# Altium project lorawan_gateway.PrjPcb (part 1 of 2)
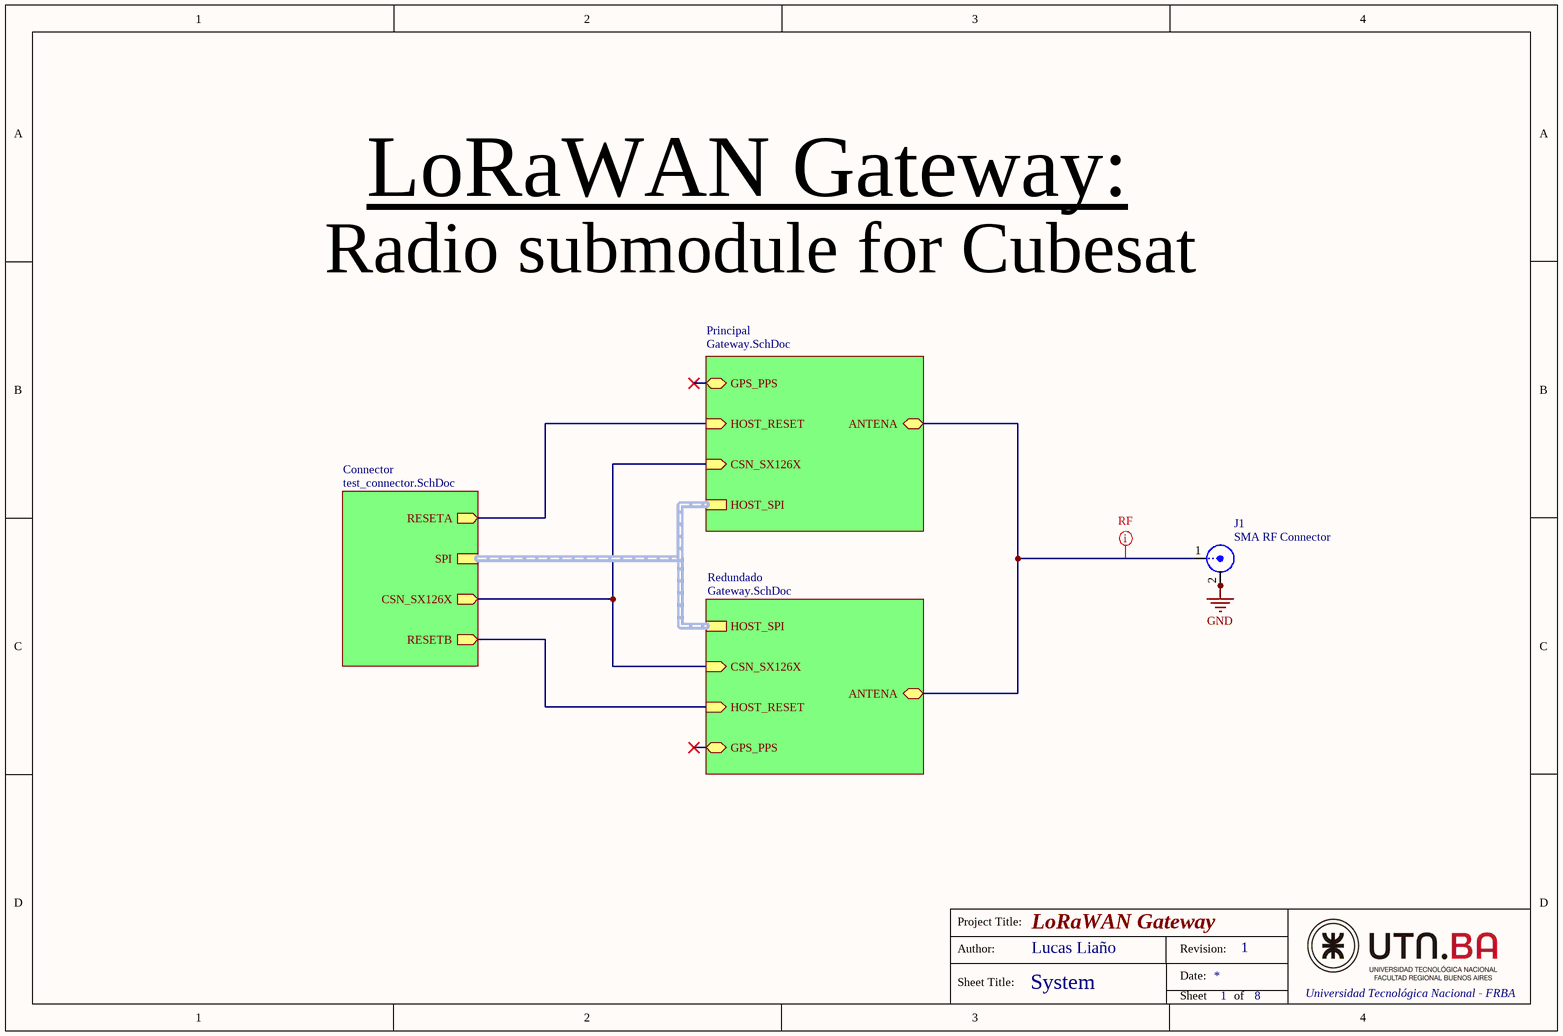
[diagram p0: System.SchDoc]
ProjectTitle: LoRaWAN Gateway; UTN: Universidad Tecnológica Nacional - FRBA
8 sheets, 253 parts. Net scope: hierarchical (ports join the sheet entries above them; power ports are global).
Board files: pci_104.PcbDoc, panel.PcbDoc
Sheets:
  System.SchDoc
    Principal = Gateway.SchDoc
      SX1302 = SX1302.SchDoc
      RADIOA = SX1250.SchDoc
      RADIOB = SX1250.SchDoc
      RADIOC = SX126x.SchDoc
      FrontEnd = FrontEnd.SchDoc
      Power = Power.SchDoc
    Redundado = Gateway.SchDoc
      SX1302 = SX1302.SchDoc
      RADIOA = SX1250.SchDoc
      RADIOB = SX1250.SchDoc
      RADIOC = SX126x.SchDoc
      FrontEnd = FrontEnd.SchDoc
      Power = Power.SchDoc
    Connector = test_connector.SchDoc

## Sheet System.SchDoc: System
size A4; Author: Lucas Liaño; Revision: 1; SheetNumber: 1; SheetTotal: 8

### Parts
J1  SMA RF Connector  [SMA THT connector]

### Sub-sheets
Connector = test_connector.SchDoc: SPI (harness HOST_SPI), RESETA (out), RESETB (out), CSN_SX126X (out)
Principal = Gateway.SchDoc: GPS_PPS (bidir), HOST_RESET (in), ANTENA (bidir), HOST_SPI (harness HOST_SPI), CSN_SX126X (in)
Redundado = Gateway.SchDoc: ANTENA (bidir), GPS_PPS (bidir), HOST_RESET (in), HOST_SPI (harness HOST_SPI), CSN_SX126X (in)

### Nets
GND: J1.2(GND)
GPIO1: sheet Principal/HOST_RESET, sheet Connector/RESETA
GPIO2: sheet Redundado/HOST_RESET, sheet Connector/RESETB
SPI_CSN_SX126X: sheet Principal/CSN_SX126X, sheet Redundado/CSN_SX126X, sheet Connector/CSN_SX126X
NetC41A_1: J1.1(Signal) ; sheet Principal/ANTENA, sheet Redundado/ANTENA

### Buses and harness runs
harness sheet Connector/SPI = sheet Principal/HOST_SPI = sheet Redundado/HOST_SPI

### Layout directives
net class RF: NetC41A_1

### Notes on the sheet
- LoRaWAN Gateway:
- Radio submodule for Cubesat
- Project Title:
- Author:
- Sheet Title:
- Date:
- Revision:
- Sheet
- of

### Library data of the parts
J1 = SMA: SMA 50 Ohm military grade THT connector; Manufacturer: TE Connectivity Aerospace, Defense and Marine; MPN: 1053374-1; Value: SMA female; ComponentLink1Description: Datasheet; ComponentLink1URL: https://www.te.com/commerce/DocumentDelivery/DDEController?Action=srchrtrv&DocNm=1053374&DocType=Customer+Drawing&DocLang=English; ComponentLink2Description: SupplierLink; ComponentLink2URL: https://www.digikey.com/en/products/detail/te-connectivity-aerospace-defense-and-marine/1053374-1/1131391; Package: SMA; Price (USD): 56; Supplier: Digikey

## Sheet Gateway.SchDoc: Gateway
size A3; Author: Lucas Liaño; Revision: 1; SheetNumber: 2; SheetTotal: 8
Used 2 times, as channels Principal, Redundado. Parts and nets are listed once, with the designators drawn on the sheet.
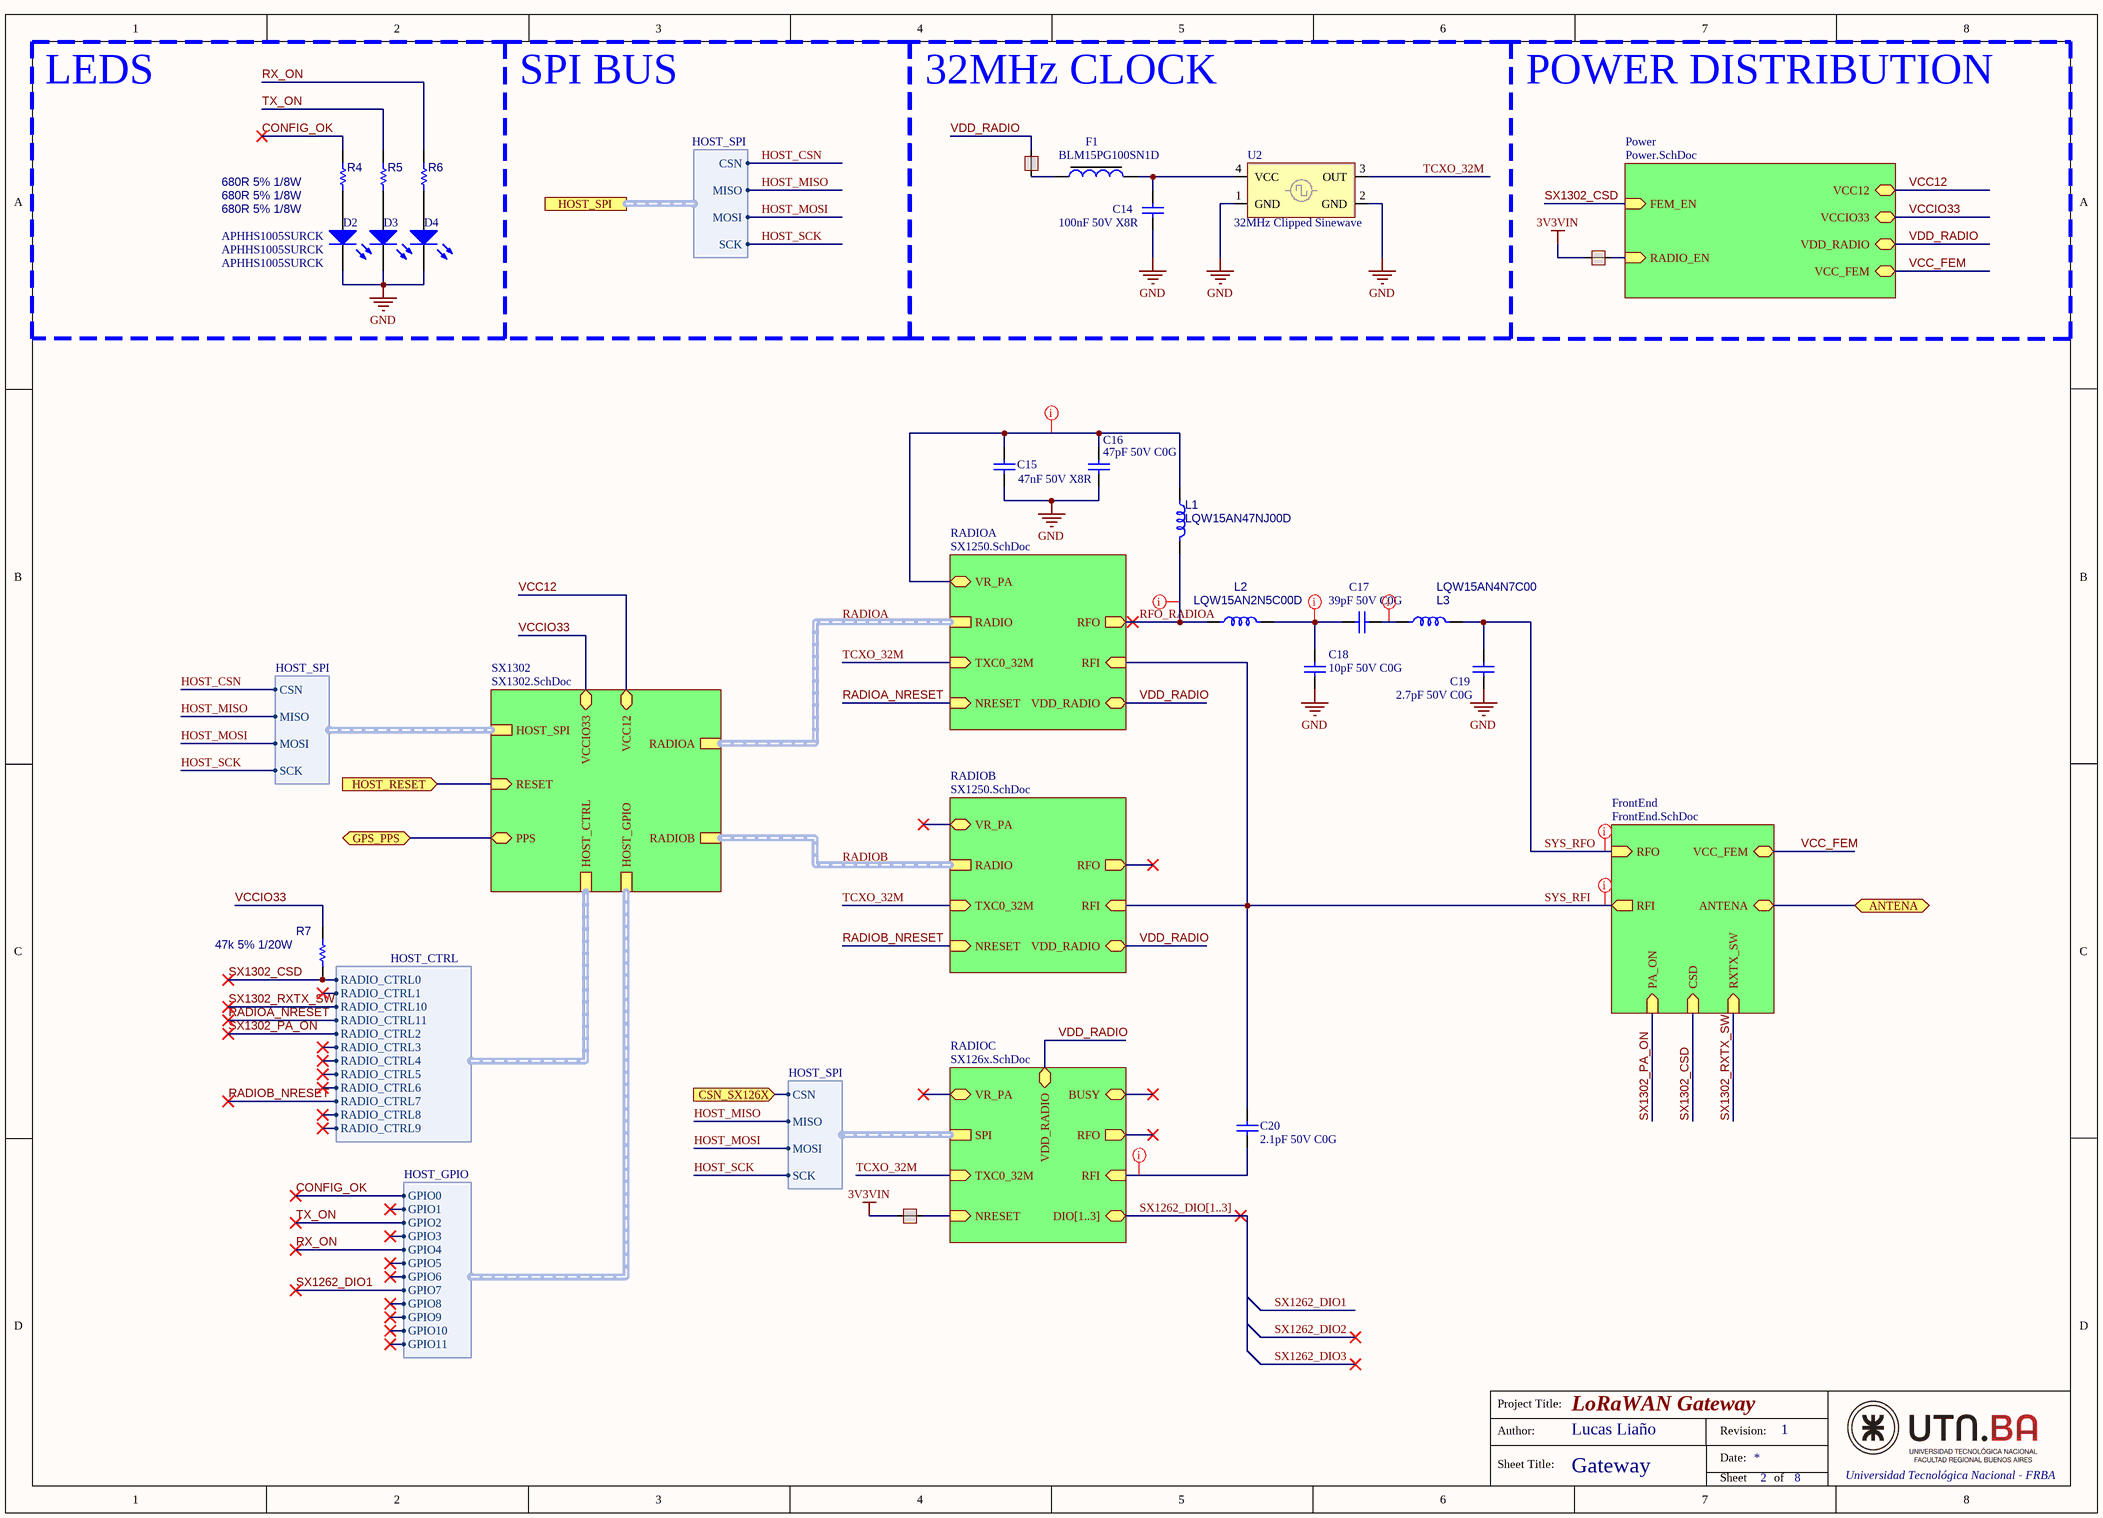
[diagram p1: Gateway.SchDoc]

### Parts
C14  100nF 50V X8R  [C_0603]
C15  47nF 50V X8R  [C_0603]
C16  47pF 50V C0G  [C_0603]
C17  39pF 50V C0G  [C_0603]
C18  10pF 50V C0G  [C_0603]
C19  2.7pF 50V C0G  [C_0603]
C20  2.1pF 50V C0G  [C_0603]
D2  APHHS1005SURCK  [D_0402]
D3  APHHS1005SURCK  [D_0402]
D4  APHHS1005SURCK  [D_0402]
F1  BLM15PG100SN1D  [L_0402]
L1  LQW15AN47NJ00D  [L_0402]
L2  LQW15AN2N5C00D  [L_0402]
L3  LQW15AN4N7C00  [L_0402]
NT1  NT  [NTIE12]  (value not drawn)  (net tie, no BOM)
NT13  NT  [NTIE12]  (value not drawn)  (net tie, no BOM)
NT15  NT  [NTIE12]  (value not drawn)  (net tie, no BOM)
R4  680R 5% 1/8W  [0603[1608]]
R5  680R 5% 1/8W  [0603[1608]]
R6  680R 5% 1/8W  [0603[1608]]
R7  47k 5% 1/20W  [0603[1608]]
U2  32MHz Clipped Sinewave  [TCXO 2.0x1.6mm]

### Blocks framed on the sheet
LEDS: D2-D4 R4-R6

### Sub-sheets
FrontEnd = FrontEnd.SchDoc: ANTENA (bidir), RFO (in), RFI (out), PA_ON (in), CSD (in), RXTX_SW (in), VCC_FEM (bidir)
Power = Power.SchDoc: FEM_EN (in), RADIO_EN (in), VCC12 (bidir), VCCIO33 (bidir), VDD_RADIO (bidir), VCC_FEM (bidir)
RADIOA = SX1250.SchDoc: RFI (in), VR_PA (bidir), RADIO (harness RADIO), NRESET (in), RFO (out), TXC0_32M (in), VDD_RADIO (bidir)
RADIOB = SX1250.SchDoc: VR_PA (bidir), RFO (out), RADIO (harness RADIO), NRESET (in), RFI (in), TXC0_32M (in), VDD_RADIO (bidir)
RADIOC = SX126x.SchDoc: RFI (in), DIO[1..3] (bidir), RFO (out), NRESET (in), SPI (harness HOST_SPI), VR_PA (bidir), TXC0_32M (in), BUSY (bidir), VDD_RADIO (bidir)
SX1302 = SX1302.SchDoc: RADIOB (harness RADIO), HOST_GPIO (harness HOST_GPIO), PPS (bidir), RESET (in), RADIOA (harness RADIO), HOST_CTRL (harness HOST_CTRL), HOST_SPI (harness HOST_SPI), VCCIO33 (bidir), VCC12 (bidir)

### Ports
ANTENA (bidir), CSN_SX126X (in), GPS_PPS (bidir), HOST_RESET (in), HOST_SPI (harness HOST_SPI)

### Harnesses
HOST_CTRL: RADIO_CTRL0, RADIO_CTRL1, RADIO_CTRL10, RADIO_CTRL11, RADIO_CTRL2, RADIO_CTRL3, RADIO_CTRL4, RADIO_CTRL5, RADIO_CTRL6, RADIO_CTRL7, RADIO_CTRL8, RADIO_CTRL9
HOST_GPIO: GPIO1, GPIO2, GPIO3, GPIO4, GPIO5, GPIO6, GPIO7, GPIO8, GPIO9, GPIO10, GPIO11, GPIO0
HOST_SPI: CSN, MISO, MOSI, SCK

### Nets
3V3VIN: NT1.1 NT15.1
GND: C14.2 C15.2 C16.2 C18.1 C19.2 D2.2(K) D3.2(K) D4.2(K) U2.1(GND) U2.2(GND)
ANTENA: port ANTENA, sheet FrontEnd/ANTENA
CONFIG_OK: R4.2 ; sheet SX1302/HOST_GPIO.GPIO0
CSN_SX126X: port CSN_SX126X, sheet RADIOC/SPI.CSN
GPS_PPS: port GPS_PPS, sheet SX1302/PPS
HOST_CSN: port HOST_SPI.CSN, sheet SX1302/HOST_SPI.CSN
HOST_MISO: port HOST_SPI.MISO, sheet SX1302/HOST_SPI.MISO, sheet RADIOC/SPI.MISO
HOST_MOSI: port HOST_SPI.MOSI, sheet SX1302/HOST_SPI.MOSI, sheet RADIOC/SPI.MOSI
HOST_RESET: port HOST_RESET, sheet SX1302/RESET
HOST_SCK: port HOST_SPI.SCK, sheet SX1302/HOST_SPI.SCK, sheet RADIOC/SPI.SCK
RADIOA_NRESET: sheet RADIOA/NRESET, sheet SX1302/HOST_CTRL.RADIO_CTRL11
RADIOB_NRESET: sheet RADIOB/NRESET, sheet SX1302/HOST_CTRL.RADIO_CTRL7
RFO_RADIOA: L1.2 L2.1 ; sheet RADIOA/RFO
RX_ON: R6.2 ; sheet SX1302/HOST_GPIO.GPIO4
SX1302_CSD: R7.1 ; sheet FrontEnd/CSD, sheet Power/FEM_EN, sheet SX1302/HOST_CTRL.RADIO_CTRL0
SX1302_PA_ON: sheet FrontEnd/PA_ON, sheet SX1302/HOST_CTRL.RADIO_CTRL2
SX1302_RXTX_SW: sheet FrontEnd/RXTX_SW, sheet SX1302/HOST_CTRL.RADIO_CTRL10
SYS_RFI: C20.2 ; sheet RADIOA/RFI, sheet RADIOB/RFI, sheet FrontEnd/RFI
SYS_RFO: C19.1 L3.2 ; sheet FrontEnd/RFO
TCXO_32M: U2.3(OUT) ; sheet RADIOA/TXC0_32M, sheet RADIOB/TXC0_32M, sheet RADIOC/TXC0_32M
TX_ON: R5.2 ; sheet SX1302/HOST_GPIO.GPIO2
VCC12: sheet SX1302/VCC12, sheet Power/VCC12
VCC_FEM: sheet FrontEnd/VCC_FEM, sheet Power/VCC_FEM
VCCIO33: R7.2 ; sheet SX1302/VCCIO33, sheet Power/VCCIO33
VDD_RADIO: NT13.2 ; sheet RADIOA/VDD_RADIO, sheet RADIOB/VDD_RADIO, sheet RADIOC/VDD_RADIO, sheet Power/VDD_RADIO
NetC14_1: C14.1 F1.2 U2.4(VCC)
NetC15_1: C15.1 C16.1 L1.1 ; sheet RADIOA/VR_PA
NetC17_1: C17.1 C18.2 L2.2
NetC17_2: C17.2 L3.1
NetC20_1: C20.1 ; sheet RADIOC/RFI
NetD2_1: D2.1(A) R4.1
NetD3_1: D3.1(A) R5.1
NetD4_1: D4.1(A) R6.1
NetF1_1: F1.1 NT13.1
NetNT1_2: NT1.2 ; sheet RADIOC/NRESET
NetNT15_2: NT15.2 ; sheet Power/RADIO_EN

### Channels
Principal: designators end in A; ports ANTENA=NetC41A_1 CSN_SX126X=SPI_CSN_SX126X GPS_PPS=PPS_SX1302 HOST_RESET=GPIO1
Redundado: designators end in B; ports ANTENA=NetC41A_1 CSN_SX126X=SPI_CSN_SX126X GPS_PPS=PPS_SX1302 HOST_RESET=GPIO2

### Buses and harness runs
bus SX1262_DIO[1..3] = sheet RADIOC/DIO[1..3]
harness RADIOA = sheet RADIOA/RADIO = sheet SX1302/RADIOA
harness RADIOB = sheet RADIOB/RADIO = sheet SX1302/RADIOB

### Layout directives
net class RF: NetC17A_1, NetC17A_2, NetC20A_1, RFO_RADIOA_Principal, SYS_RFI_Principal, SYS_RFO_Principal, VR_PA

### Notes on the sheet
- SPI BUS
- 32MHz CLOCK
- POWER DISTRIBUTION
- Project Title:
- Author:
- Sheet Title:
- Date:
- Revision:
- Sheet
- of

### Library data of the parts
C14 = Cap: Capacitor; MPN: GCM188R91H102KA37D; Manufacturer: Murata Electronics; Package: 0603; Price (USD): 0.2; ComponentLink2Description: SupplierLink; ComponentLink1Description: Datasheet; ComponentLink2URL: https://www.digikey.com/es/products/detail/murata-electronics/GCM188R91H102KA37D/6605989; ComponentLink1URL: https://search.murata.co.jp/Ceramy/image/img/A01X/G101/ENG/GCM188R91H102KA37-01.pdf; Value: 100nF 50V X8R; Supplier: Digikey
C15 = Cap: Capacitor; MPN: GCM188R91H472KA37D; Manufacturer: Murata Electronics; Package: 0603; Price (USD): 0.2; ComponentLink2Description: SupplierLink; ComponentLink1Description: Datasheet; ComponentLink2URL: https://www.digikey.com/es/products/detail/murata-electronics/GCM188R91H472KA37D/11618640; ComponentLink1URL: https://search.murata.co.jp/Ceramy/image/img/A01X/G101/ENG/GCM188R91H472KA37-01.pdf; Value: 47nF 50V X8R; Supplier: Digikey
C16 = Cap: Capacitor; MPN: 0603J0500470GAT; Manufacturer: Knowless Syfer; Package: 0603; Price (USD): 0.25; ComponentLink2Description: SupplierLink; ComponentLink1Description: Datasheet; ComponentLink2URL: https://www.digikey.com/es/products/detail/knowles-syfer/0603J0500470GAT/6285001; ComponentLink1URL: https://www.knowlescapacitors.com/getmedia/44a5a400-a1aa-40c4-ac69-22b5f3d40f81/AEC-Q200-Automotive-Grade-Capacitors-Catalog; Value: 47pF 50V C0G; Supplier: Digikey
C17 = Cap: Capacitor; MPN: 06035A390FAT2A; Manufacturer: Kyocera AVX; Package: 0603; Price (USD): 0.45; ComponentLink2Description: SupplierLink; ComponentLink1Description: Datasheet; ComponentLink2URL: https://www.digikey.com/es/products/detail/kyocera-avx/06035A390FAT2A/1599819; ComponentLink1URL: https://datasheets.kyocera-avx.com/C0GNP0-Dielectric.pdf; Value: 39pF 50V C0G; Supplier: Digikey
C18 = Cap: Capacitor; MPN: GRM0335C1H100FA01D; Manufacturer: Murata Electronics; Package: 0603; Price (USD): 0.1; ComponentLink2Description: SupplierLink; ComponentLink1Description: Datasheet; ComponentLink2URL: https://www.digikey.com/es/products/detail/murata-electronics/GRM0335C1H100FA01D/4358087; ComponentLink1URL: https://search.murata.co.jp/Ceramy/image/img/A01X/G101/ENG/GRM0335C1H100FA01-01.pdf; Value: 10pF 50V C0G; Supplier: Digikey
C19 = Cap: Capacitor; MPN: GRM0335C1H2R7WA01D; Manufacturer: Murata Electronics; Package: 0603; Price (USD): 0.1; ComponentLink2Description: SupplierLink; ComponentLink1Description: Datasheet; ComponentLink2URL: https://www.digikey.com/es/products/detail/murata-electronics/GRM0335C1H2R7WA01D/11618507?s=N4IgTCBcDaIOICUCyAGAzGgrAYQIwAkwEB2AdQEEVcAREAXQF8g; ComponentLink1URL: https://search.murata.co.jp/Ceramy/image/img/A01X/G101/ENG/GRM0335C1H2R7WA01-01.pdf; Value: 2.7pF 50V C0G; Supplier: Digikey
C20 = Cap: Capacitor; MPN: ML03512R1BAT2A; Manufacturer: Kyocera AVX; Package: 0603; Price (USD): 0.52; ComponentLink2Description: SupplierLink; ComponentLink1Description: Datasheet; ComponentLink2URL: https://www.digikey.com/es/products/detail/kyocera-avx/ML03512R1BAT2A/2694197; ComponentLink1URL: https://datasheets.kyocera-avx.com/ML03.pdf; Value: 2.1pF 50V C0G; Supplier: Digikey
D2-D4 = LED: Manufacturer: kingbright; Value: LED RED CLEAR CHIP SMD; ComponentLink1Description: Datasheet; ComponentLink2Description: SupplierLink; MPN: APHHS1005SURCK; Package: 0402  [1005]; Price (USD): 0.5; Supplier: Digikey
  D2: ComponentLink1URL: https://www.kingbrightusa.com/images/catalog/SPEC/APHHS1005SURCK.pdf; ComponentLink2URL: https://www.digikey.com/en/products/detail/kingbright/APHHS1005SURCK/1747502
F1 = Ferrite beads: Ferrite bead 10 ohm 1A; Manufacturer: Murata Electronics; ComponentLink1Description: Datasheet; ComponentLink2Description: SupplierLink; MPN: BLM15PG100SN1D; Package: 0402; Price (USD): 0.1; Supplier: Digikey; Value: Ferrite bead 10 ohm 1A
L1-L3 = IND: Inductor; Manufacturer: *; Package: *; Price (USD): *; Value: *; ComponentLink1Description: Datasheet; ComponentLink1URL: *; ComponentLink2Description: SupplierLink; ComponentLink2URL: *
  L1: MPN: LQW15AN47NJ00D
  L2: MPN: LQW15AN2N5C00D
  L3: MPN: LQW15AN4N7C00
NT1 NT13 NT15 = NTIE: NET_TIE; ComponentLink1Description: Datasheet; ComponentLink2Description: SupplierLink
R4-R6 = Res: Resistor; Manufacturer: Panasonic Electronic Components; MPN: ERJ-H3GJ681V; Package: 0603; Price (USD): 0.17; Value: 680R 5% 1/8W; ComponentLink1Description: Datasheet; ComponentLink2Description: SupplierLink; Supplier: Digikey
  R4: ComponentLink1URL: https://www.digikey.com/es/products/detail/panasonic-electronic-components/ERJ-H3GJ681V/13877999; ComponentLink2URL: https://www.digikey.com/es/products/detail/panasonic-electronic-components/ERJ-H3GJ681V/13877999
  R5 R6: ComponentLink1URL: *; ComponentLink2URL: *
R7 = Res: Resistor; Manufacturer: Vishay; MPN: M55342K11B47K0MT1V; Package: 0603; Price (USD): 0.2; Value: 47k 5% 1/20W; ComponentLink1Description: Datasheet; ComponentLink1URL: https://www.digikey.com/es/products/detail/vishay-dale-thin-film/M55342K11B47K0MT1V/3585297?s=N4IgjCBcoExaBjKAzAhgGwM4FMA0IB7KAbRAHYBWGAFhAF18AHAFyhAGVmAnASwDsA5iAC%2B%2BAMzwQSSGix5CJEDAoAGCQxAs2nXoJH4wANknTZOfEUikxATjAUAHPSatIHbvyGilKhxRMoGOYKViDUZAAEANYA8gAWALaYzpquIACqfDzMMcgAstiomACuXNgi3nChZZg8mMwEXMl0wkA; ComponentLink2Description: SupplierLink; ComponentLink2URL: https://www.digikey.com/es/products/detail/vishay-dale-thin-film/M55342K11B47K0MT1V/3585297?s=N4IgjCBcoExaBjKAzAhgGwM4FMA0IB7KAbRAHYBWGAFhAF18AHAFyhAGVmAnASwDsA5iAC%2B%2BAMzwQSSGix5CJEDAoAGCQxAs2nXoJH4wANknTZOfEUikxATjAUAHPSatIHbvyGilKhxRMoGOYKViDUZAAEANYA8gAWALaYzpquIACqfDzMMcgAstiomACuXNgi3nChZZg8mMwEXMl0wkA; Supplier: Digikey
U2 = TCXO: 32MHz TCXO - Clipped Sinewave Output; Manufacturer: NDK America; MPN: NT2016SA 32MHz END4263A; ComponentLink1Description: Datasheet; ComponentLink1URL: https://media.digikey.com/pdf/Data%20Sheets/NDK%20PDFs/NT2016SA-32M-END4263A.pdf; ComponentLink2Description: SupplierLink; ComponentLink2URL: https://www.digikey.com/en/products/detail/ndk-america-inc/NT2016SA-32M-END4263A/8275433; Package: 4-SMD; Price (USD): 1; Supplier: Digikey; Value: 32MHz TCXO - Clipped Sinewave Output

## Sheet SX1302.SchDoc: SX1302
size A2; Author: Lucas Liaño; Revision: 1; SheetNumber: 3; SheetTotal: 8
Used 2 times, as channels Principal/SX1302, Redundado/SX1302. Parts and nets are listed once, with the designators drawn on the sheet.
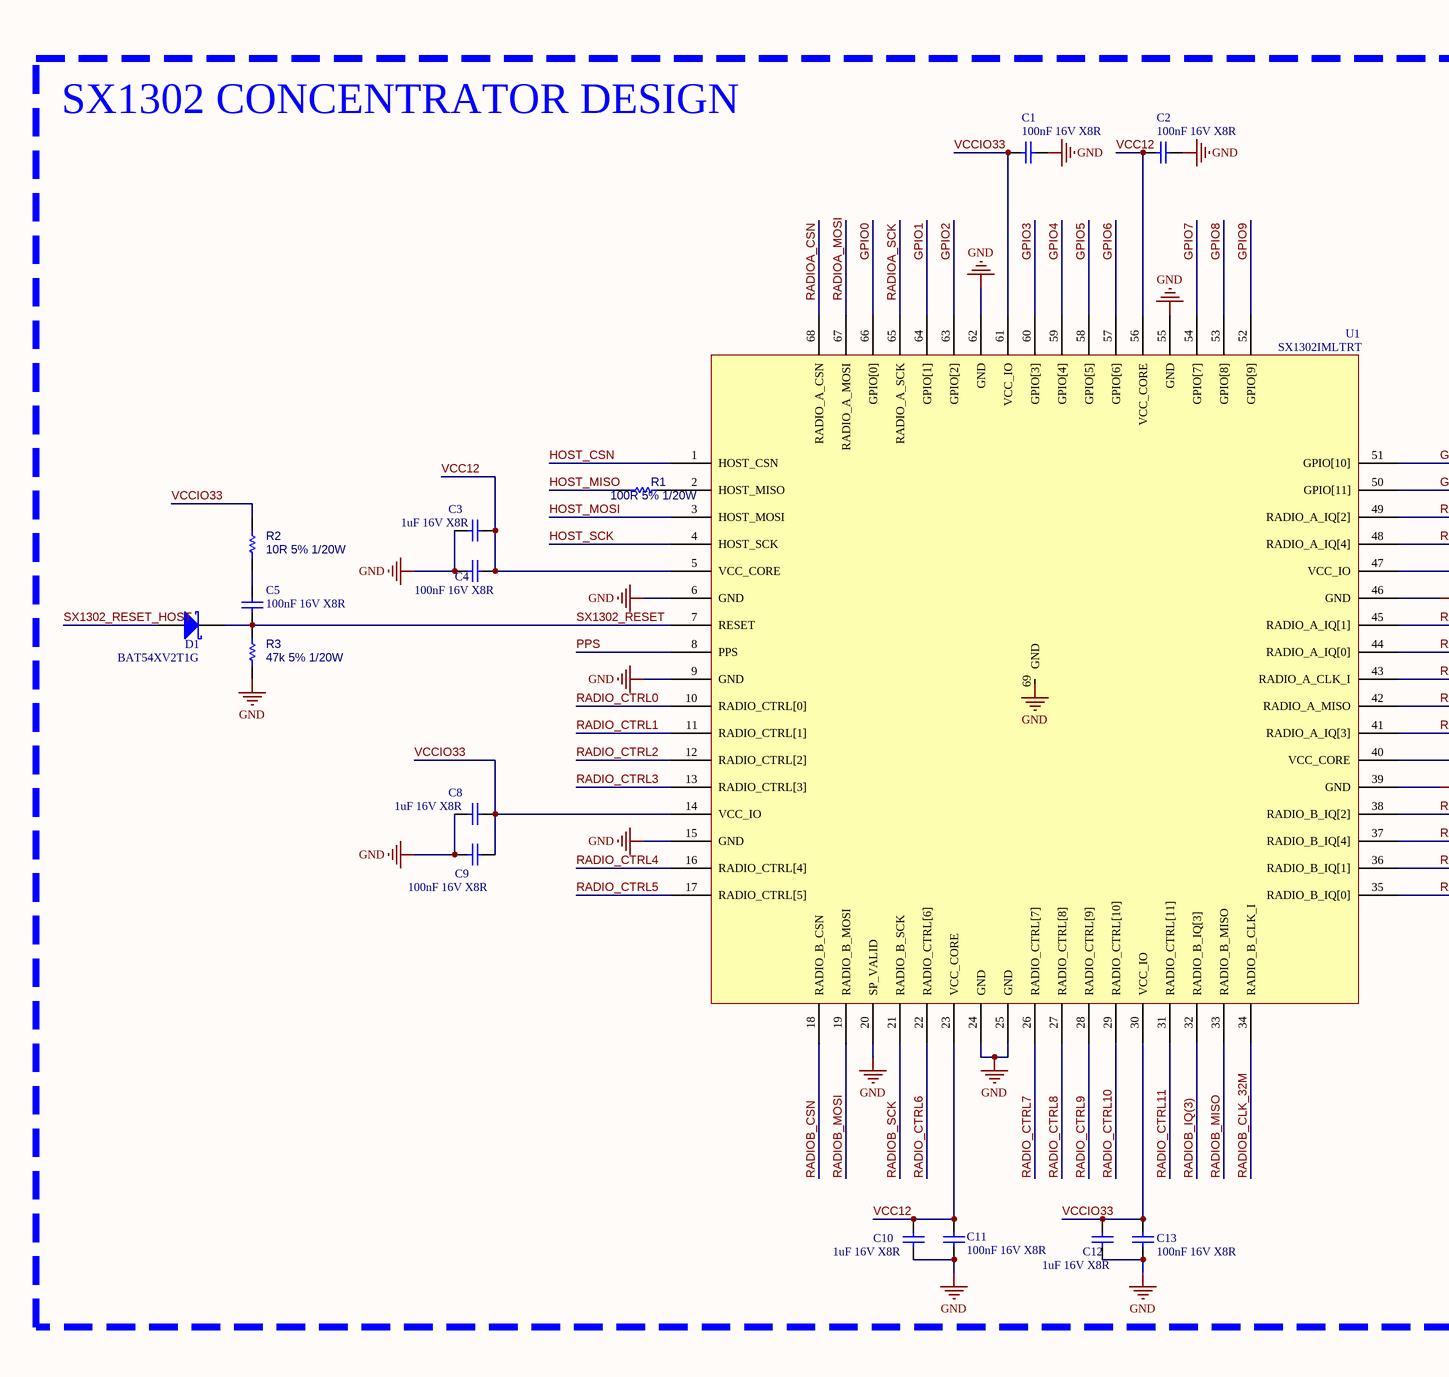
[diagram p2: SX1302.SchDoc, left]
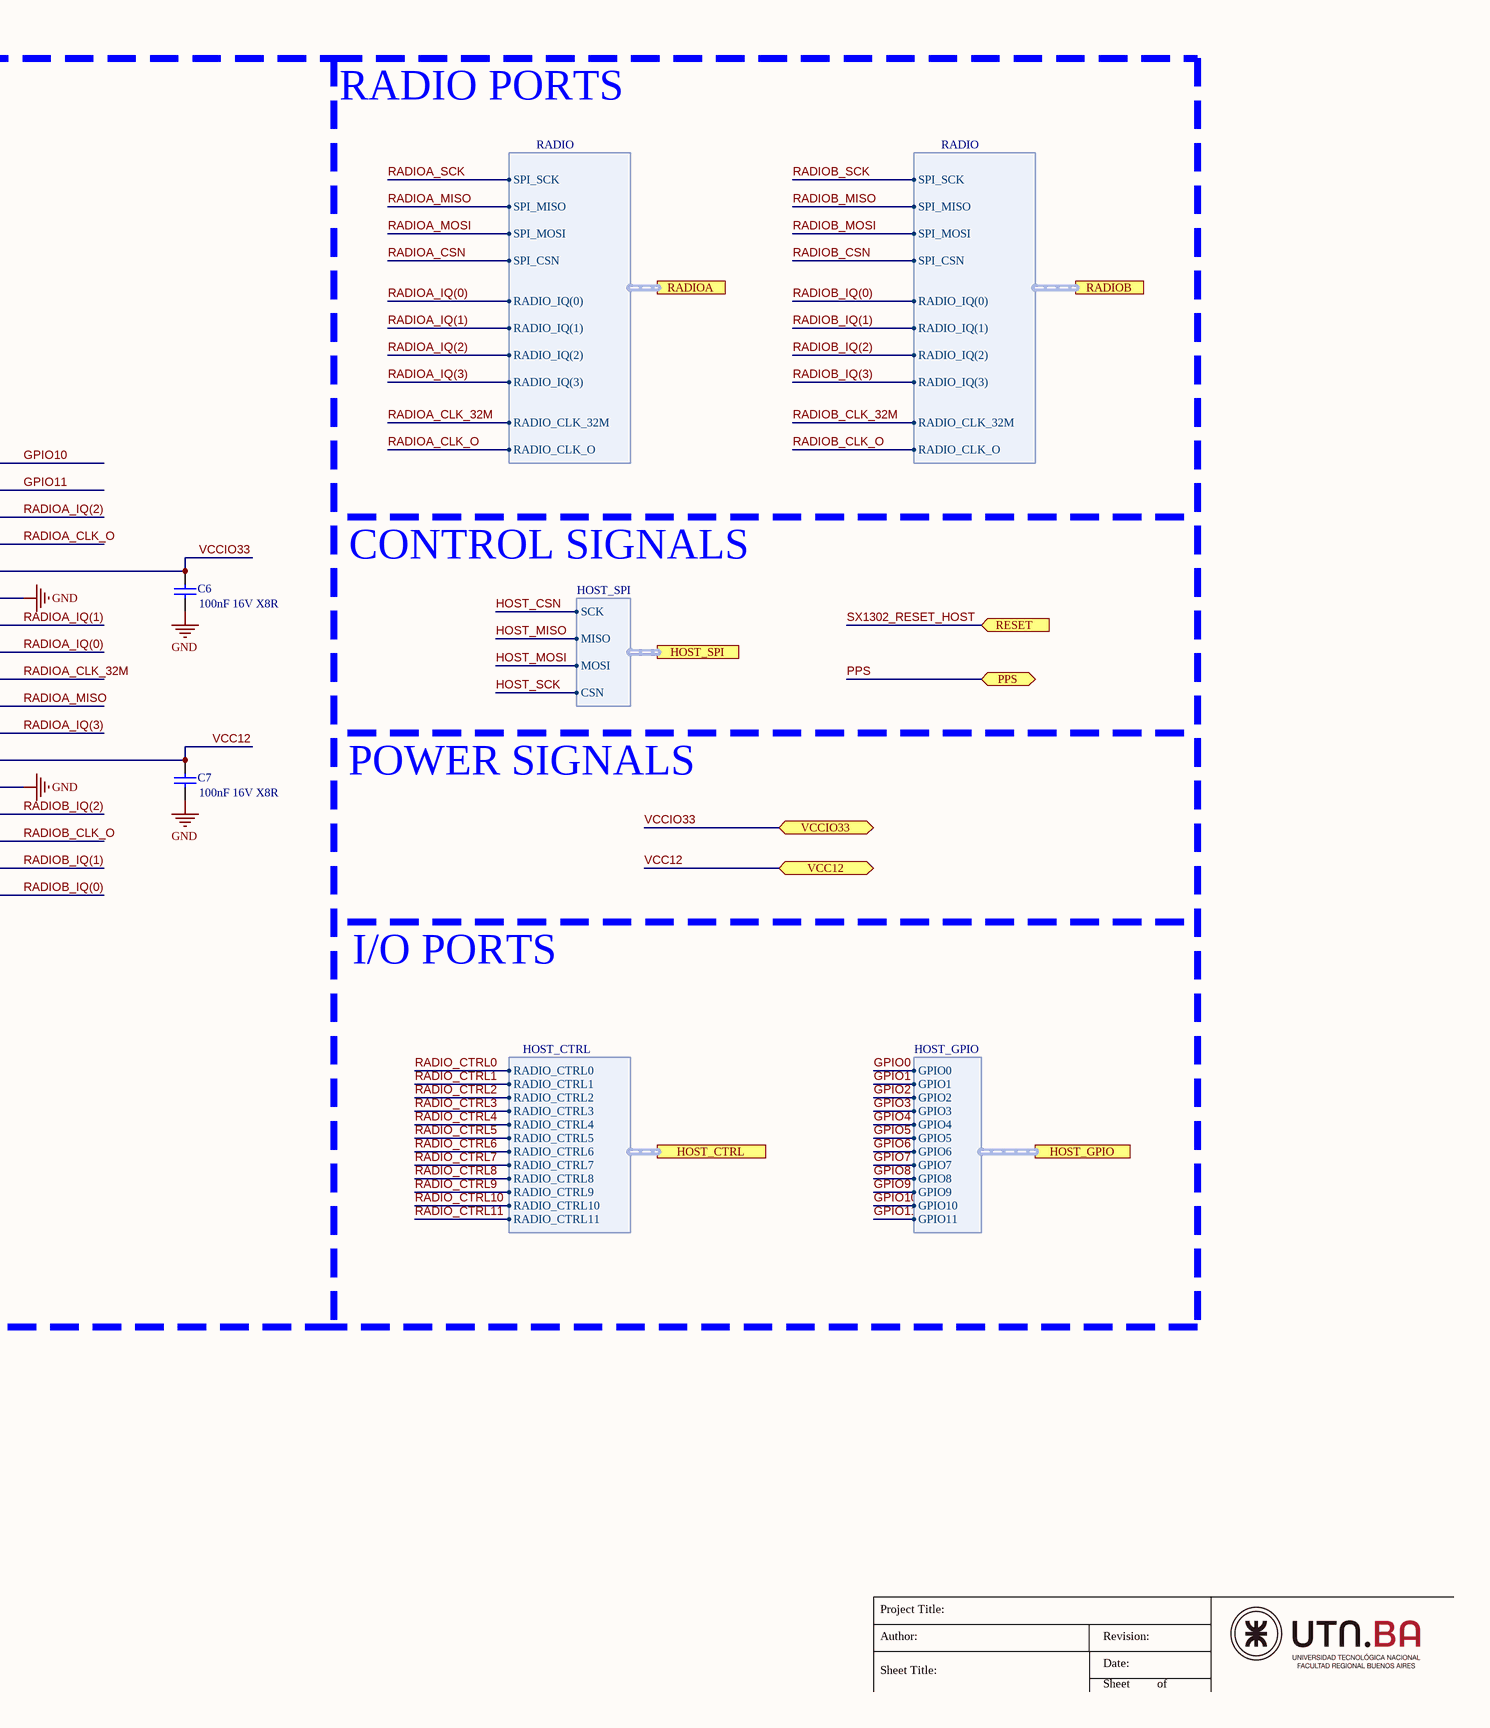
[diagram p3: SX1302.SchDoc, right]

### Parts
C1  100nF 16V X8R  [C_0603]
C2  100nF 16V X8R  [C_0603]
C3  1uF 16V X8R  [C_0603]
C4  100nF 16V X8R  [C_0603]
C5  100nF 16V X8R  [C_0603]
C6  100nF 16V X8R  [C_0603]
C7  100nF 16V X8R  [C_0603]
C8  1uF 16V X8R  [C_0603]
C9  100nF 16V X8R  [C_0603]
C10  1uF 16V X8R  [C_0603]
C11  100nF 16V X8R  [C_0603]
C12  1uF 16V X8R  [C_0603]
C13  100nF 16V X8R  [C_0603]
D1  BAT54XV2T1G  [SOD-523]
R1  100R 5% 1/20W  [0603[1608]]
R2  10R 5% 1/20W  [0603[1608]]
R3  47k 5% 1/20W  [0603[1608]]
U1  SX1302IMLTRT  [vqfn68_7x7mm]

### Blocks framed on the sheet
SX1302 CONCENTRATOR DESIGN: C1-C13 D1 R1-R3 U1

### Ports
HOST_CTRL (harness HOST_CTRL), HOST_GPIO (harness HOST_GPIO), HOST_SPI (harness HOST_SPI), PPS (bidir), RADIOA (harness RADIO), RADIOB (harness RADIO), RESET (in), VCC12 (bidir), VCCIO33 (bidir)

### Harnesses
RADIO: SPI_SCK, SPI_MISO, SPI_MOSI, SPI_CSN, RADIO_IQ(0), RADIO_IQ(1), RADIO_IQ(2), RADIO_IQ(3), RADIO_CLK_32M, RADIO_CLK_O
HOST_SPI: SCK, MISO, MOSI, CSN
HOST_CTRL: RADIO_CTRL0, RADIO_CTRL1, RADIO_CTRL2, RADIO_CTRL3, RADIO_CTRL4, RADIO_CTRL5, RADIO_CTRL6, RADIO_CTRL7, RADIO_CTRL8, RADIO_CTRL9, RADIO_CTRL10, RADIO_CTRL11
HOST_GPIO: GPIO1, GPIO2, GPIO3, GPIO4, GPIO5, GPIO6, GPIO7, GPIO8, GPIO9, GPIO10, GPIO11, GPIO0

### Nets
GND: C1.1 C2.1 C3.1 C4.1 C6.1 C7.1 C8.1 C9.1 C10.1 C11.1 C12.1 C13.1 R3.1 U1.6(GND) U1.9(GND) U1.15(GND) U1.20(SP_VALID) U1.24(GND) U1.25(GND) U1.39(GND) U1.46(GND) U1.55(GND) U1.62(GND) U1.69(GND)
GPIO0: U1.66(GPIO[0]) ; port HOST_GPIO.GPIO0
GPIO1: U1.64(GPIO[1]) ; port HOST_GPIO.GPIO1
GPIO2: U1.63(GPIO[2]) ; port HOST_GPIO.GPIO2
GPIO3: U1.60(GPIO[3]) ; port HOST_GPIO.GPIO3
GPIO4: U1.59(GPIO[4]) ; port HOST_GPIO.GPIO4
GPIO5: U1.58(GPIO[5]) ; port HOST_GPIO.GPIO5
GPIO6: U1.57(GPIO[6]) ; port HOST_GPIO.GPIO6
GPIO7: U1.54(GPIO[7]) ; port HOST_GPIO.GPIO7
GPIO8: U1.53(GPIO[8]) ; port HOST_GPIO.GPIO8
GPIO9: U1.52(GPIO[9]) ; port HOST_GPIO.GPIO9
GPIO10: U1.51(GPIO[10]) ; port HOST_GPIO.GPIO10
GPIO11: U1.50(GPIO[11]) ; port HOST_GPIO.GPIO11
HOST_CSN: U1.1(HOST_CSN) ; port HOST_SPI.SCK
HOST_MISO: R1.2 ; port HOST_SPI.MISO
HOST_MOSI: U1.3(HOST_MOSI) ; port HOST_SPI.MOSI
HOST_SCK: U1.4(HOST_SCK) ; port HOST_SPI.CSN
PPS: U1.8(PPS) ; port PPS
RADIO_CTRL0: U1.10(RADIO_CTRL[0]) ; port HOST_CTRL.RADIO_CTRL0
RADIO_CTRL1: U1.11(RADIO_CTRL[1]) ; port HOST_CTRL.RADIO_CTRL1
RADIO_CTRL2: U1.12(RADIO_CTRL[2]) ; port HOST_CTRL.RADIO_CTRL2
RADIO_CTRL3: U1.13(RADIO_CTRL[3]) ; port HOST_CTRL.RADIO_CTRL3
RADIO_CTRL4: U1.16(RADIO_CTRL[4]) ; port HOST_CTRL.RADIO_CTRL4
RADIO_CTRL5: U1.17(RADIO_CTRL[5]) ; port HOST_CTRL.RADIO_CTRL5
RADIO_CTRL6: U1.22(RADIO_CTRL[6]) ; port HOST_CTRL.RADIO_CTRL6
RADIO_CTRL7: U1.26(RADIO_CTRL[7]) ; port HOST_CTRL.RADIO_CTRL7
RADIO_CTRL8: U1.27(RADIO_CTRL[8]) ; port HOST_CTRL.RADIO_CTRL8
RADIO_CTRL9: U1.28(RADIO_CTRL[9]) ; port HOST_CTRL.RADIO_CTRL9
RADIO_CTRL10: U1.29(RADIO_CTRL[10]) ; port HOST_CTRL.RADIO_CTRL10
RADIO_CTRL11: U1.31(RADIO_CTRL[11]) ; port HOST_CTRL.RADIO_CTRL11
RADIOA_CLK_32M: U1.43(RADIO_A_CLK_I) ; port RADIOA.RADIO_CLK_32M
RADIOA_CLK_O: U1.48(RADIO_A_IQ[4]) ; port RADIOA.RADIO_CLK_O
RADIOA_CSN: U1.68(RADIO_A_CSN) ; port RADIOA.SPI_CSN
RADIOA_IQ(0): U1.44(RADIO_A_IQ[0]) ; port RADIOA.RADIO_IQ(0)
RADIOA_IQ(1): U1.45(RADIO_A_IQ[1]) ; port RADIOA.RADIO_IQ(1)
RADIOA_IQ(2): U1.49(RADIO_A_IQ[2]) ; port RADIOA.RADIO_IQ(2)
RADIOA_IQ(3): U1.41(RADIO_A_IQ[3]) ; port RADIOA.RADIO_IQ(3)
RADIOA_MISO: U1.42(RADIO_A_MISO) ; port RADIOA.SPI_MISO
RADIOA_MOSI: U1.67(RADIO_A_MOSI) ; port RADIOA.SPI_MOSI
RADIOA_SCK: U1.65(RADIO_A_SCK) ; port RADIOA.SPI_SCK
RADIOB_CLK_32M: U1.34(RADIO_B_CLK_I) ; port RADIOB.RADIO_CLK_32M
RADIOB_CLK_O: U1.37(RADIO_B_IQ[4]) ; port RADIOB.RADIO_CLK_O
RADIOB_CSN: U1.18(RADIO_B_CSN) ; port RADIOB.SPI_CSN
RADIOB_IQ(0): U1.35(RADIO_B_IQ[0]) ; port RADIOB.RADIO_IQ(0)
RADIOB_IQ(1): U1.36(RADIO_B_IQ[1]) ; port RADIOB.RADIO_IQ(1)
RADIOB_IQ(2): U1.38(RADIO_B_IQ[2]) ; port RADIOB.RADIO_IQ(2)
RADIOB_IQ(3): U1.32(RADIO_B_IQ[3]) ; port RADIOB.RADIO_IQ(3)
RADIOB_MISO: U1.33(RADIO_B_MISO) ; port RADIOB.SPI_MISO
RADIOB_MOSI: U1.19(RADIO_B_MOSI) ; port RADIOB.SPI_MOSI
RADIOB_SCK: U1.21(RADIO_B_SCK) ; port RADIOB.SPI_SCK
SX1302_RESET: C5.1 D1.1(K) R3.2 U1.7(RESET)
SX1302_RESET_HOST: D1.2(A) ; port RESET
VCC12: C2.2 C3.2 C4.2 C7.2 C10.2 C11.2 U1.5(VCC_CORE) U1.23(VCC_CORE) U1.40(VCC_CORE) U1.56(VCC_CORE) ; port VCC12
VCCIO33: C1.2 C6.2 C8.2 C9.2 C12.2 C13.2 R2.2 U1.14(VCC_IO) U1.30(VCC_IO) U1.47(VCC_IO) U1.61(VCC_IO) ; port VCCIO33
NetC5_2: C5.2 R2.1
NetR1_1: R1.1 U1.2(HOST_MISO)

### Channels
Principal/SX1302: designators end in A; ports PPS=PPS_SX1302 RESET=GPIO1 VCC12=VCC12_Principal VCCIO33=VCCIO33_Principal
Redundado/SX1302: designators end in B; ports PPS=PPS_SX1302 RESET=GPIO2 VCC12=VCC12_Redundado VCCIO33=VCCIO33_Redundado

### Notes on the sheet
- RADIO PORTS
- CONTROL SIGNALS
- POWER SIGNALS
- I/O PORTS
- Project Title:
- Author:
- Sheet Title:
- Date:
- Revision:
- Sheet
- of

### Library data of the parts
C1 C2 C4-C7 C9 C11 C13 = Cap: Capacitor; MPN: C1206C104K4HACAUTO; Manufacturer: KEMET; Package: 0603; Price (USD): 0.3; ComponentLink2Description: SupplierLink; ComponentLink1Description: Datasheet; Value: 100nF 16V X8R; Supplier: Digikey
  C1 C2 C4-C7 C11 C13: ComponentLink2URL: *; ComponentLink1URL: *
  C9: ComponentLink2URL: https://www.digikey.com/es/products/detail/kemet/C1206C104K4HACAUTO/7961523; ComponentLink1URL: https://connect.kemet.com:7667/gateway/IntelliData-ComponentDocumentation/1.0/download/datasheet/C1206C104K4HACAUTO
C3 C8 C10 C12 = Cap: Capacitor; MPN: CGA4J3X8R1C105K125AB; Manufacturer: TDK Corporation; Package: 0603; Price (USD): 0.4; ComponentLink2Description: SupplierLink; ComponentLink1Description: Datasheet; Value: 1uF 16V X8R; Supplier: Digikey
  C3: ComponentLink2URL: https://www.digikey.com/es/products/detail/tdk-corporation/CGA4J3X8R1C105K125AB/3950048; ComponentLink1URL: https://www.digikey.com/es/products/detail/tdk-corporation/CGA4J3X8R1C105K125AB/3950048
  C8 C10 C12: ComponentLink2URL: *; ComponentLink1URL: *
D1 = D Schottky: DIODE SCHOTTKY 30V 200MA SOD523; Manufacturer: onsemi; ComponentLink1Description: Datasheet; ComponentLink1URL: https://www.onsemi.com/pdf/datasheet/bat54xv2t1-d.pdf; ComponentLink2Description: SupplierLink; ComponentLink2URL: https://www.digikey.com/en/products/detail/onsemi/BAT54XV2T1G/918321; MPN: BAT54XV2T1G; Package: SOD-523; Price (USD): 0.26; Supplier: Digikey; Value: DIODE SCHOTTKY 30V 200MA SOD523
R1 = Res: Resistor; Manufacturer: Stackpole; MPN: RMCF0201JT100R; Package: 0603; Price (USD): 0.1; Value: 100R 5% 1/20W; ComponentLink1Description: Datasheet; ComponentLink1URL: *; ComponentLink2Description: SupplierLink; ComponentLink2URL: *; Supplier: Digikey
R2 = Res: Resistor; Manufacturer: CH0402-10RJFPT; MPN: Vishay; Package: 0603; Price (USD): 0.2; Value: 10R 5% 1/20W; ComponentLink1Description: Datasheet; ComponentLink1URL: https://www.vishay.com/docs/53014/ch-cha.pdf; ComponentLink2Description: SupplierLink; ComponentLink2URL: https://www.digikey.com/es/products/detail/vishay-sfernice/CH0402-10RJFPT/10757682; Supplier: Digikey
R3 = Res: as R7 on sheet Gateway; Package: 0603; Price (USD): 0.2; Value: 47k 5% 1/20W; ComponentLink1Description: Datasheet; ComponentLink1URL: *; ComponentLink2Description: SupplierLink; ComponentLink2URL: *; Supplier: Digikey
U1 = SX1302: LoRa Core™ Digital Baseband Chip for LoRaWAN network gateways; Manufacturer: Semtech; Value: SX1302; ComponentLink1Description: Datasheet; ComponentLink1URL: https://media.digikey.com/pdf/Data%20Sheets/Semtech%20PDFs/SX1302_rev1.1_Jan2020.pdf; ComponentLink2Description: SupplierLink; ComponentLink2URL: https://www.digikey.com/en/products/detail/SX1302IMLTRT/600-SX1302IMLTRTCT-ND/10379524?WT.z_cid=ref_netcomponents_dkc_buynow&utm_source=netcomponents&utm_medium=aggregator&utm_campaign=buynow; MPN: SX1302IMLTRT; Package: QFN 7x7mm P=0.35mm; Price (USD): 37.75; Supplier: Digikey

## Sheet SX1250.SchDoc: SX1250
size A4; Author: Lucas Liaño; Revision: 1; SheetNumber: 4; SheetTotal: 8
Used 4 times, as channels Principal/RADIOA, Principal/RADIOB, Redundado/RADIOA, Redundado/RADIOB. Parts and nets are listed once, with the designators drawn on the sheet.
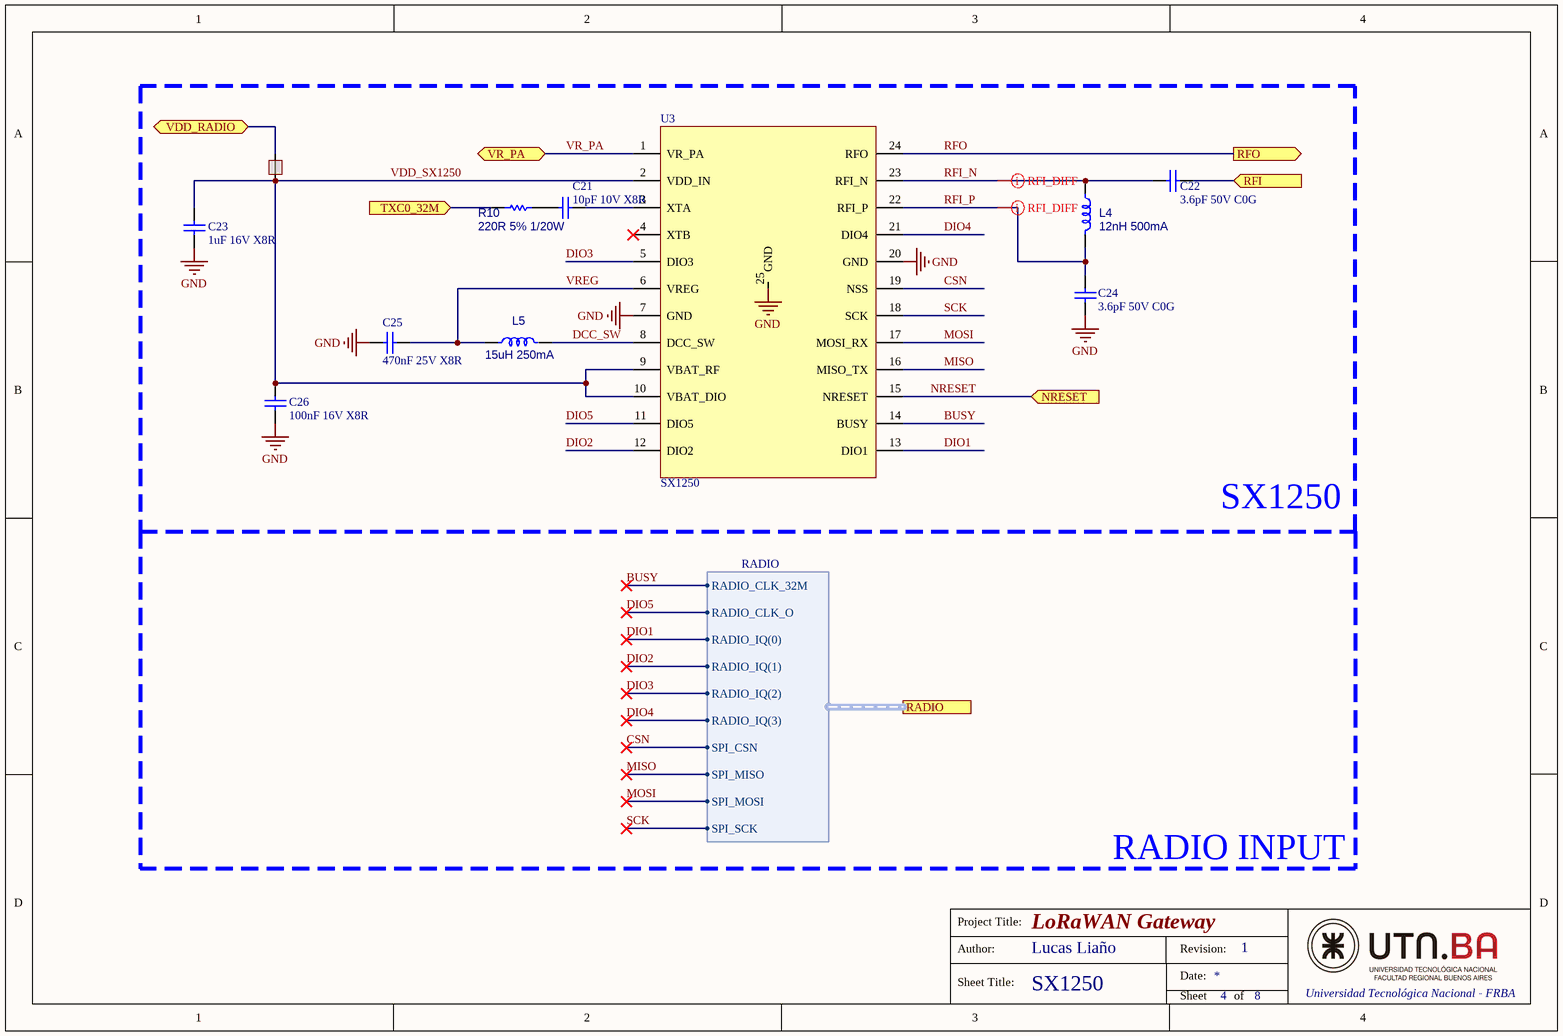
[diagram p4: SX1250.SchDoc]

### Parts
C21  10pF 10V X8R  [C_0603]
C22  3.6pF 50V C0G  [C_0603]
C23  1uF 16V X8R  [C_0603]
C24  3.6pF 50V C0G  [C_0603]
C25  470nF 25V X8R  [C_0603]
C26  100nF 16V X8R  [C_0603]
L4  12nH 500mA  [L_0402]
L5  15uH 250mA  [0805[2012]]
NT16  NT  [NTIE24]  (value not drawn)  (net tie, no BOM)
R10  220R 5% 1/20W  [0603[1608]]
U3  SX1250  [vqfn24_4x4mm]

### Blocks framed on the sheet
SX1250: C21-C26 L4 L5 NT16 R10 U3

### Ports
NRESET (in), RADIO (harness RADIO), RFI (in), RFO (out), TXC0_32M (in), VDD_RADIO (bidir), VR_PA (bidir)

### Harnesses
RADIO: RADIO_CLK_32M, RADIO_CLK_O, RADIO_IQ(0), RADIO_IQ(1), RADIO_IQ(2), RADIO_IQ(3), SPI_CSN, SPI_MISO, SPI_MOSI, SPI_SCK

### Nets
GND: C23.2 C24.2 C25.2 C26.2 U3.7(GND) U3.20(GND) U3.25(GND)
BUSY: U3.14(BUSY) ; port RADIO.RADIO_CLK_32M
CSN: U3.19(NSS) ; port RADIO.SPI_CSN
DCC_SW: L5.2 U3.8(DCC_SW)
DIO1: U3.13(DIO1) ; port RADIO.RADIO_IQ(0)
DIO2: U3.12(DIO2) ; port RADIO.RADIO_IQ(1)
DIO3: U3.5(DIO3) ; port RADIO.RADIO_IQ(2)
DIO4: U3.21(DIO4) ; port RADIO.RADIO_IQ(3)
DIO5: U3.11(DIO5) ; port RADIO.RADIO_CLK_O
MISO: U3.16(MISO_TX) ; port RADIO.SPI_MISO
MOSI: U3.17(MOSI_RX) ; port RADIO.SPI_MOSI
NRESET: U3.15(NRESET) ; port NRESET
RFI: C22.2 ; port RFI
RFI_N: C22.1 L4.1 U3.23(RFI_N)
RFI_P: C24.1 L4.2 U3.22(RFI_P)
RFO: U3.24(RFO) ; port RFO
SCK: U3.18(SCK) ; port RADIO.SPI_SCK
TXC0_32M: R10.1 ; port TXC0_32M
VDD_RADIO: NT16.2 ; port VDD_RADIO
VDD_SX1250: C23.1 C26.1 NT16.1 U3.2(VDD_IN) U3.9(VBAT_RF) U3.10(VBAT_DIO)
VR_PA: U3.1(VR_PA) ; port VR_PA
VREG: C25.1 L5.1 U3.6(VREG)
NetC21_1: C21.1 U3.3(XTA)
NetC21_2: C21.2 R10.2

Not connected (* = marked no-connect by the designer): U3 4(XTB)*

### Channels
Principal/RADIOA: designators end in A; ports NRESET=RADIOA_NRESET_Principal RFI=SYS_RFI_Principal RFO=RFO_RADIOA_Principal TXC0_32M=TCXO_32M_Principal VDD_RADIO=VDD_RADIO_Principal VR_PA=VR_PA
Principal/RADIOB: designators end in B; ports NRESET=RADIOB_NRESET_Principal RFI=SYS_RFI_Principal RFO=RFO_RADIOB TXC0_32M=TCXO_32M_Principal VDD_RADIO=VDD_RADIO_Principal VR_PA=VR_PA_RADIOB
Redundado/RADIOA: designators end in C; ports NRESET=RADIOA_NRESET_Redundado RFI=SYS_RFI_Redundado RFO=RFO_RADIOA_Redundado TXC0_32M=TCXO_32M_Redundado VDD_RADIO=VDD_RADIO_Redundado VR_PA=VR_PA
Redundado/RADIOB: designators end in D; ports NRESET=RADIOB_NRESET_Redundado RFI=SYS_RFI_Redundado RFO=RFO_RADIOB TXC0_32M=TCXO_32M_Redundado VDD_RADIO=VDD_RADIO_Redundado VR_PA=VR_PA_RADIOB

### Layout directives
differential pair; differential pair class RFI_DIFF: RFI_N_RADIOA, RFI_P_RADIOA

### Notes on the sheet
- Project Title:
- RADIO INPUT
- Author:
- Sheet Title:
- Date:
- Revision:
- Sheet
- of

### Library data of the parts
C21 = Cap: Capacitor; MPN: C0603X100J8HACAUTO; Manufacturer: KEMET; Package: 0603; Price (USD): 0.1; ComponentLink2Description: SupplierLink; ComponentLink1Description: Datasheet; ComponentLink2URL: https://www.digikey.com/es/products/detail/kemet/C0603X100J8HACAUTO/8325671; ComponentLink1URL: https://www.digikey.com/es/products/detail/kemet/C0603X100J8HACAUTO/8325671; Value: 10pF 10V X8R; Supplier: Digikey
C22 C24 = Cap: Capacitor; MPN: GJM0335C1H3R6WB01; Manufacturer: Murata Electronics; Package: 0603; Price (USD): 0.2; ComponentLink2Description: SupplierLink; ComponentLink1Description: Datasheet; Value: 3.6pF 50V C0G; Supplier: Digikey
  C22: ComponentLink2URL: *; ComponentLink1URL: *
  C24: ComponentLink2URL: https://www.digikey.com/es/products/detail/murata-electronics/GJM0335C1H3R6WB01D/16033898?s=N4IgTCBcDaIOICkCyAGAzGgrAYQIwAk0AlANgHUAhFXEAXQF8g; ComponentLink1URL: https://www.digikey.com/es/products/detail/murata-electronics/GJM0335C1H3R6WB01D/16033898?s=N4IgTCBcDaIOICkCyAGAzGgrAYQIwAk0AlANgHUAhFXEAXQF8g
C23 = Cap: as C3 on sheet SX1302; Package: 0603; Price (USD): 0.4; ComponentLink2Description: SupplierLink; ComponentLink1Description: Datasheet; ComponentLink2URL: *; ComponentLink1URL: *; Value: 1uF 16V X8R; Supplier: Digikey
C25 = Cap: Capacitor; MPN: VJ0603H472JXXAC; Manufacturer: Vishay; Package: 0603; Price (USD): 0.2; ComponentLink2Description: SupplierLink; ComponentLink1Description: Datasheet; ComponentLink2URL: https://www.digikey.com/es/products/detail/vishay-vitramon/VJ0603H472JXXAC/8304887; ComponentLink1URL: https://www.digikey.com/es/products/detail/vishay-vitramon/VJ0603H472JXXAC/8304887; Value: 470nF 25V X8R; Supplier: Digikey
C26 = Cap: as C1 on sheet SX1302; Package: 0603; Price (USD): 0.3; ComponentLink2Description: SupplierLink; ComponentLink1Description: Datasheet; ComponentLink2URL: *; ComponentLink1URL: *; Value: 100nF 16V X8R; Supplier: Digikey
L4 = IND: Inductor; Manufacturer: Murata Electronics; MPN: LQW15AN12NH00D; Package: 0402; Price (USD): 0.17; Value: 12nH 500mA; ComponentLink1Description: Datasheet; ComponentLink1URL: https://www.digikey.com/es/products/detail/murata-electronics/LQW15AN12NH00D/2594852?s=N4IgTCBcDaIDIEUDqBGArAQQHIrFgEgAyEAiIAugL5A; ComponentLink2Description: SupplierLink; ComponentLink2URL: https://www.digikey.com/es/products/detail/murata-electronics/LQW15AN12NH00D/2594852?s=N4IgTCBcDaIDIEUDqBGArAQQHIrFgEgAyEAiIAugL5A; Supplier: Digikey
L5 = IND: FIXED IND 15UH 250MA 950MOHM SMD; Manufacturer: TDK Corporation; MPN: MLZ2012M150WT000; Package: 0805; Price (USD): 0.13; Value: 15uH 250mA; ComponentLink1Description: Datasheet; ComponentLink1URL: https://www.digikey.com/es/products/detail/tdk-corporation/MLZ2012M150WT000/2465154; ComponentLink2Description: SupplierLink; ComponentLink2URL: https://www.digikey.com/es/products/detail/tdk-corporation/MLZ2012M150WT000/2465154; Supplier: Digikey
NT16 = NTIE: NET_TIE; ComponentLink1Description: Datasheet; ComponentLink2Description: SupplierLink
R10 = Res: Resistor; Manufacturer: Panasonic Electronic Components; MPN: ERJ-1GNJ221C; Package: 0603; Price (USD): 0.1; Value: 220R 5% 1/20W; ComponentLink1Description: Datasheet; ComponentLink1URL: https://www.digikey.com/es/products/detail/panasonic-electronic-components/ERJ-1GNJ221C/2035771; ComponentLink2Description: SupplierLink; ComponentLink2URL: https://www.digikey.com/es/products/detail/panasonic-electronic-components/ERJ-1GNJ221C/2035771; Supplier: Digikey
U3 = SX1250: SX1250 - Ultra low power RF Front-End; Manufacturer: Semtech; MPN: SX1250IMLTRT; Value: SUB-GHZ RF FRONT END TRANSCIEVER; ComponentLink1Description: Datasheet; ComponentLink1URL: https://semtech.my.salesforce.com/sfc/p/#E0000000JelG/a/2R000000HTAF/wqCYqYPC0Z5rgGvER7_RtmlGeQhc31idv6bvSW4c_FQ; ComponentLink2Description: SupplierLink; ComponentLink2URL: https://www.digikey.com/en/products/detail/semtech-corporation/SX1250IMLTRT/10379521?s=N4IgTCBcDaIM4A8CMYCsAGEBdAvkA; Package: 24-VFQFN; Price (USD): 10; Supplier: Digikey

## Sheet SX126x.SchDoc: SX126x
size A4; Author: Lucas Liaño; Revision: 1; SheetNumber: 5; SheetTotal: 8
Used 2 times, as channels Principal/RADIOC, Redundado/RADIOC. Parts and nets are listed once, with the designators drawn on the sheet.
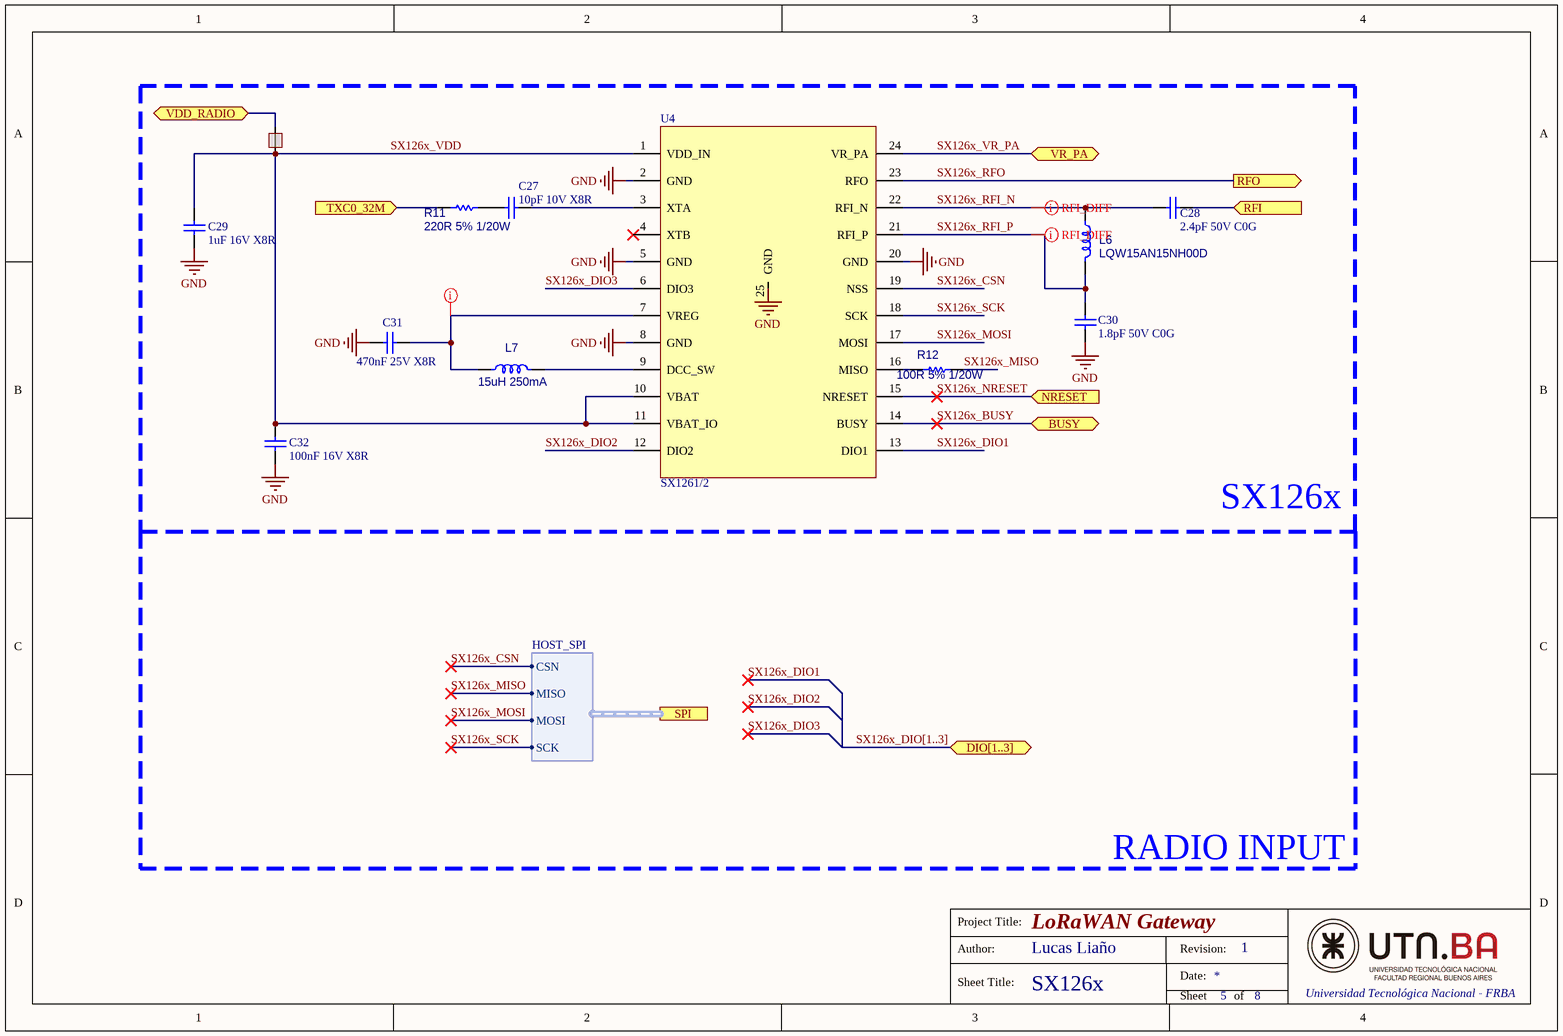
[diagram p5: SX126x.SchDoc]

### Parts
C27  10pF 10V X8R  [C_0603]
C28  2.4pF 50V C0G  [C_0603]
C29  1uF 16V X8R  [C_0603]
C30  1.8pF 50V C0G  [C_0603]
C31  470nF 25V X8R  [C_0603]
C32  100nF 16V X8R  [C_0603]
L6  LQW15AN15NH00D  [L_0402]
L7  15uH 250mA  [0805[2012]]
NT17  NT  [NTIE24]  (value not drawn)  (net tie, no BOM)
R11  220R 5% 1/20W  [0603[1608]]
R12  100R 5% 1/20W  [0603[1608]]
U4  SX1261/2  [vqfn24_4x4mm]

### Blocks framed on the sheet
SX126x: C27-C32 L6 L7 NT17 R11 R12 U4

### Ports
BUSY (bidir), DIO[1..3] (bidir), NRESET (in), RFI (in), RFO (out), SPI (harness HOST_SPI), TXC0_32M (in), VDD_RADIO (bidir), VR_PA (bidir)

### Harnesses
HOST_SPI: CSN, MISO, MOSI, SCK

### Nets
GND: C29.2 C30.2 C31.2 C32.2 U4.2(GND) U4.5(GND) U4.8(GND) U4.20(GND) U4.25(GND)
RFI: C28.2 ; port RFI
SX126x_BUSY: U4.14(BUSY) ; port BUSY
SX126x_CSN: U4.19(NSS) ; port SPI.CSN
SX126x_DIO1: U4.13(DIO1)
SX126x_DIO2: U4.12(DIO2)
SX126x_DIO3: U4.6(DIO3)
SX126x_MISO: R12.1 ; port SPI.MISO
SX126x_MOSI: U4.17(MOSI) ; port SPI.MOSI
SX126x_NRESET: U4.15(NRESET) ; port NRESET
SX126x_RFI_N: C28.1 L6.1 U4.22(RFI_N)
SX126x_RFI_P: C30.1 L6.2 U4.21(RFI_P)
SX126x_RFO: U4.23(RFO) ; port RFO
SX126x_SCK: U4.18(SCK) ; port SPI.SCK
SX126x_VDD: C29.1 C32.1 NT17.1 U4.1(VDD_IN) U4.10(VBAT) U4.11(VBAT_IO)
SX126x_VR_PA: U4.24(VR_PA) ; port VR_PA
TXC0_32M: R11.1 ; port TXC0_32M
VDD_RADIO: NT17.2 ; port VDD_RADIO
NetC27_1: C27.1 U4.3(XTA)
NetC27_2: C27.2 R11.2
NetC31_1: C31.1 L7.1 U4.7(VREG)
NetL7_2: L7.2 U4.9(DCC_SW)
NetR12_2: R12.2 U4.16(MISO)

Not connected (* = marked no-connect by the designer): U4 4(XTB)*

### Channels
Principal/RADIOC: designators end in A; ports BUSY=SX126x_BUSY_RADIOC NRESET=SX126x_NRESET RFI=NetC20A_1 RFO=SX126x_RFO_RADIOC TXC0_32M=TCXO_32M_Principal VDD_RADIO=VDD_RADIO_Principal VR_PA=SX126x_VR_PA_RADIOC
Redundado/RADIOC: designators end in B; ports BUSY=SX126x_BUSY_RADIOC NRESET=SX126x_NRESET RFI=NetC20B_1 RFO=SX126x_RFO_RADIOC TXC0_32M=TCXO_32M_Redundado VDD_RADIO=VDD_RADIO_Redundado VR_PA=SX126x_VR_PA_RADIOC

### Buses and harness runs
bus SX126x_DIO[1..3] = port DIO[1..3]

### Layout directives
differential pair; differential pair class RFI_DIFF: SX126x_RFI_N_RADIOC, SX126x_RFI_P_RADIOC
rule Polygon Connect Style [Style - Direct Connect]; net class DirectConnectPolygon: NetC31A_1

### Notes on the sheet
- Project Title:
- RADIO INPUT
- Author:
- Sheet Title:
- Date:
- Revision:
- Sheet
- of

### Library data of the parts
C27 = Cap: as C21 on sheet SX1250; Package: 0603; Price (USD): 0.1; ComponentLink2Description: SupplierLink; ComponentLink1Description: Datasheet; ComponentLink2URL: *; ComponentLink1URL: *; Value: 10pF 10V X8R; Supplier: Digikey
C28 = Cap: Capacitor; MPN: GJM0335C1H2R4WB01; Manufacturer: Murata Electronics; Package: 0603; Price (USD): 0.2; ComponentLink2Description: SupplierLink; ComponentLink1Description: Datasheet; ComponentLink2URL: https://www.digikey.com/es/products/detail/murata-electronics/GJM0335C1H2R4WB01D/11618768?s=N4IgTCBcDaIOICkCyAGAzGgrAYQIwAkwAlAFgHUAhFXEAXQF8g; ComponentLink1URL: https://www.digikey.com/es/products/detail/murata-electronics/GJM0335C1H2R4WB01D/11618768?s=N4IgTCBcDaIOICkCyAGAzGgrAYQIwAkwAlAFgHUAhFXEAXQF8g; Value: 2.4pF 50V C0G; Supplier: Digikey
C29 = Cap: as C3 on sheet SX1302; Package: 0603; Price (USD): 0.4; ComponentLink2Description: SupplierLink; ComponentLink1Description: Datasheet; ComponentLink2URL: *; ComponentLink1URL: *; Value: 1uF 16V X8R; Supplier: Digikey
C30 = Cap: Capacitor; MPN: GJM0335C1H1R8WB01; Manufacturer: Murata Electronics; Package: 0603; Price (USD): 0.2; ComponentLink2Description: SupplierLink; ComponentLink1Description: Datasheet; ComponentLink2URL: https://www.digikey.com/es/products/detail/murata-electronics/GJM0335C1H1R8WB01D/11618749?s=N4IgTCBcDaIOICkCyAGAzGgrAYQIwAlcAlADgHUAhFXEAXQF8g; ComponentLink1URL: https://www.digikey.com/es/products/detail/murata-electronics/GJM0335C1H1R8WB01D/11618749?s=N4IgTCBcDaIOICkCyAGAzGgrAYQIwAlcAlADgHUAhFXEAXQF8g; Value: 1.8pF 50V C0G; Supplier: Digikey
C31 = Cap: as C25 on sheet SX1250; Package: 0603; Price (USD): 0.2; ComponentLink2Description: SupplierLink; ComponentLink1Description: Datasheet; ComponentLink2URL: *; ComponentLink1URL: *; Value: 470nF 25V X8R; Supplier: Digikey
C32 = Cap: as C1 on sheet SX1302; Package: 0603; Price (USD): 0.3; ComponentLink2Description: SupplierLink; ComponentLink1Description: Datasheet; ComponentLink2URL: *; ComponentLink1URL: *; Value: 100nF 16V X8R; Supplier: Digikey
L6 = IND: Inductor; Manufacturer: *; MPN: LQW15AN15NH00D; Package: *; Price (USD): *; Value: *; ComponentLink1Description: Datasheet; ComponentLink1URL: *; ComponentLink2Description: SupplierLink; ComponentLink2URL: *
L7 = IND: as L5 on sheet SX1250; Package: 0805; Price (USD): 0.13; Value: 15uH 250mA; ComponentLink1Description: Datasheet; ComponentLink1URL: N/C; ComponentLink2Description: SupplierLink; ComponentLink2URL: https://www.digikey.com/en/products/detail/tdk-corporation/MLZ2012M150WT000/2465154; Supplier: Digikey
NT17 = NTIE: NET_TIE; ComponentLink1Description: Datasheet; ComponentLink2Description: SupplierLink
R11 = Res: as R10 on sheet SX1250; Package: 0603; Price (USD): 0.1; Value: 220R 5% 1/20W; ComponentLink1Description: Datasheet; ComponentLink1URL: *; ComponentLink2Description: SupplierLink; ComponentLink2URL: *; Supplier: Digikey
R12 = Res: as R1 on sheet SX1302; Package: 0603; Price (USD): 0.1; Value: 100R 5% 1/20W; ComponentLink1Description: Datasheet; ComponentLink1URL: https://www.digikey.com/es/products/detail/stackpole-electronics-inc/RMCF0201JT100R/3906031; ComponentLink2Description: SupplierLink; ComponentLink2URL: https://www.digikey.com/es/products/detail/stackpole-electronics-inc/RMCF0201JT100R/3906031; Supplier: Digikey
U4 = SX126x: SX1261/2 - Ultra low power RF transceiver; Manufacturer: Semtech; MPN: SX1261IMLTRT; Value: IC RF TXRX ISM<1GHZ 24VFQFN; ComponentLink1Description: Datasheet; ComponentLink1URL: https://semtech.my.salesforce.com/sfc/p/E0000000JelG/a/2R000000HT7B/4cQ1B3JG0iKRo9DGRkjVuxclfwB.3tfSUcGr.S_dPd4; ComponentLink2Description: SupplierLink; ComponentLink2URL: https://www.digikey.com/en/products/detail/semtech-corporation/SX1261IMLTRT/8564368?s=N4IgTCBcDaIM4A8CMYBsSQF0C%2BQ; Package: 24-VFQFN; Price (USD): 8; Supplier: Digikey

## Sheet FrontEnd.SchDoc: RF Front End
size A4; Author: Lucas Liaño; Revision: 1; SheetNumber: 6; SheetTotal: 8
Used 2 times, as channels Principal/FrontEnd, Redundado/FrontEnd. Parts and nets are listed once, with the designators drawn on the sheet.
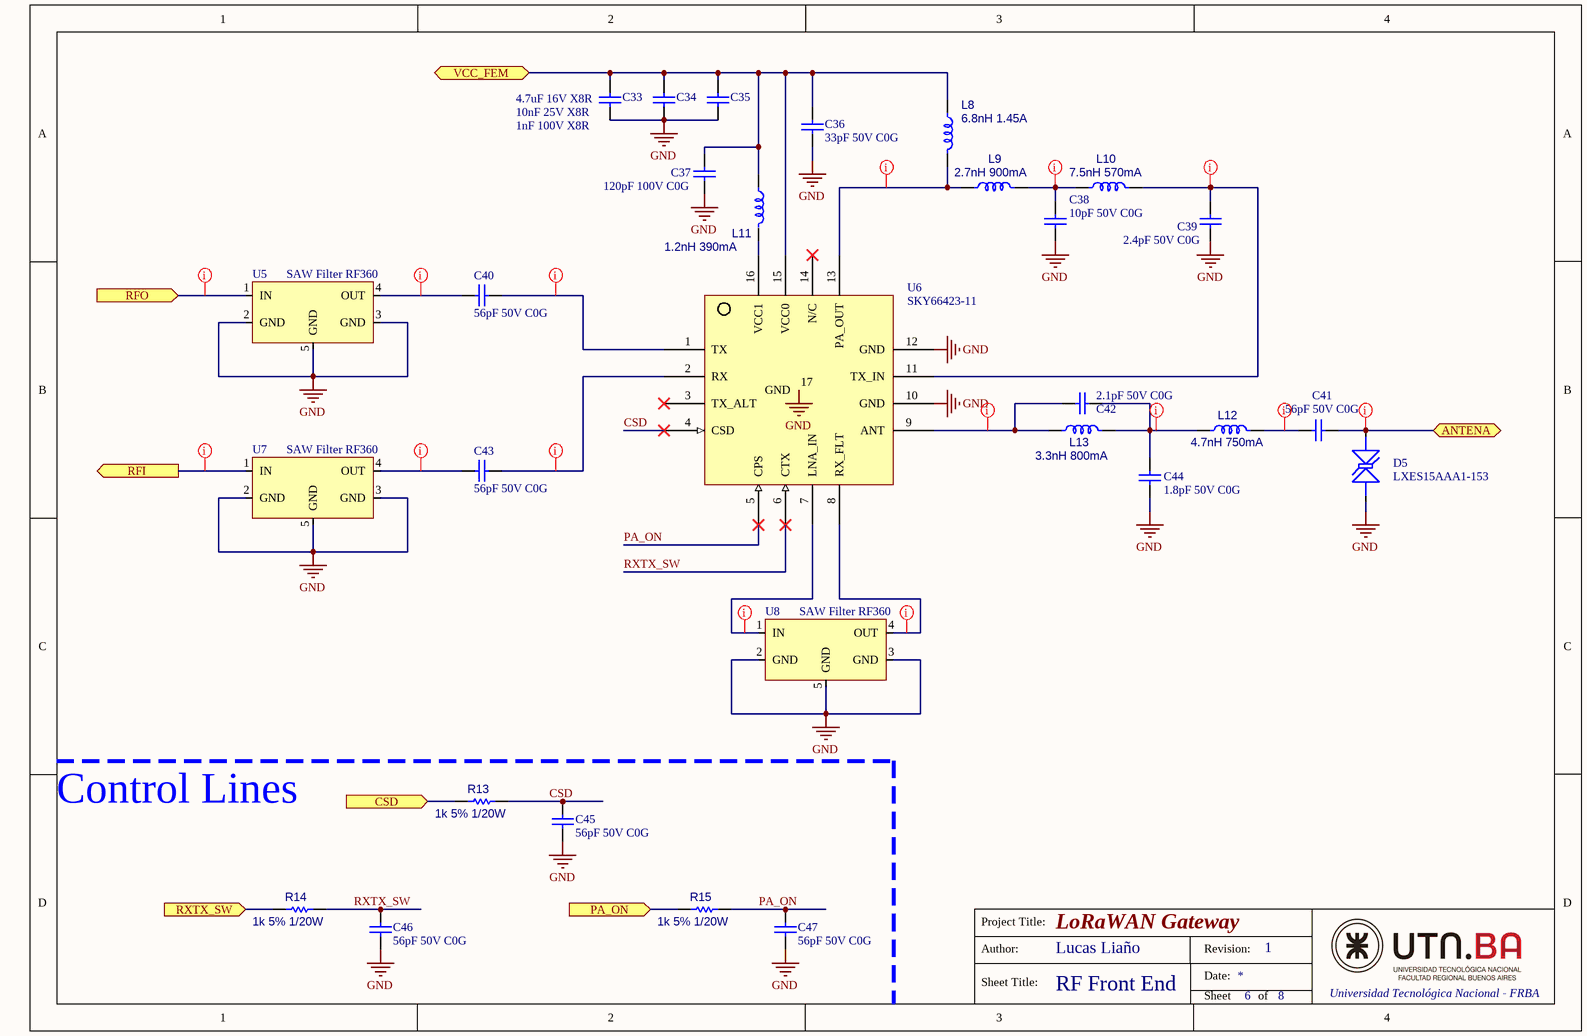
[diagram p6: FrontEnd.SchDoc]

### Parts
C33  4.7uF 16V X8R  [C_0603]
C34  10nF 25V X8R  [C_0603]
C35  1nF 100V X8R  [C_0603]
C36  33pF 50V C0G  [C_0603]
C37  120pF 100V C0G  [C_0603]
C38  10pF 50V C0G  [C_0603]
C39  2.4pF 50V C0G  [C_0603]
C40  56pF 50V C0G  [C_0603]
C41  56pF 50V C0G  [C_0603]
C42  2.1pF 50V C0G  [C_0402]
C43  56pF 50V C0G  [C_0603]
C44  1.8pF 50V C0G  [C_0603]
C45  56pF 50V C0G  [C_0603]
C46  56pF 50V C0G  [C_0603]
C47  56pF 50V C0G  [C_0603]
D5  LXES15AAA1-153  [D_0402]
L8  6.8nH 1.45A  [L_0402]
L9  2.7nH 900mA  [L_0402]
L10  7.5nH 570mA  [L_0402]
L11  1.2nH 390mA  [L_0402]
L12  4.7nH 750mA  [L_0402]
L13  3.3nH 800mA  [L_0402]
R13  1k 5% 1/20W  [0603[1608]]
R14  1k 5% 1/20W  [0603[1608]]
R15  1k 5% 1/20W  [0603[1608]]
U5  SAW Filter RF360  [QCS5P_1.4x1.1mm]
U6  SKY66423-11  [SKY66420_16P_3x3mm]
U7  SAW Filter RF360  [QCS5P_1.4x1.1mm]
U8  SAW Filter RF360  [QCS5P_1.4x1.1mm]

### Ports
ANTENA (bidir), CSD (in), PA_ON (in), RFI (out), RFO (in), RXTX_SW (in), VCC_FEM (bidir)

### Nets
GND: C33.2 C34.2 C35.2 C36.2 C37.2 C38.2 C39.2 C44.2 C45.2 C46.2 C47.2 D5.2(K) U5.2(GND) U5.3(GND) U5.5(GND) U6.10(GND) U6.12(GND) U6.17(GND) U7.2(GND) U7.3(GND) U7.5(GND) U8.2(GND) U8.3(GND) U8.5(GND)
ANTENA: C41.1 D5.1(A) ; port ANTENA
CSD: C45.1 R13.1 U6.4(CSD)
CSD: R13.2 ; port CSD  [a separate net that carries the same name]
PA_ON: C47.1 R15.1 U6.5(CPS)
PA_ON: R15.2 ; port PA_ON  [a separate net that carries the same name]
RFI: U7.1(IN) ; port RFI
RFO: U5.1(IN) ; port RFO
RXTX_SW: C46.1 R14.1 U6.6(CTX)
RXTX_SW: R14.2 ; port RXTX_SW  [a separate net that carries the same name]
VCC_FEM: C33.1 C34.1 C35.1 C36.1 C37.1 L8.1 L11.1 U6.15(VCC0) ; port VCC_FEM
NetC38_1: C38.1 L9.2 L10.1
NetC39_1: C39.1 L10.2 U6.11(TX_IN)
NetC40_1: C40.1 U5.4(OUT)
NetC40_2: C40.2 U6.1(TX)
NetC41_2: C41.2 L12.2
NetC42_1: C42.1 L13.1 U6.9(ANT)
NetC42_2: C42.2 C44.1 L12.1 L13.2
NetC43_1: C43.1 U7.4(OUT)
NetC43_2: C43.2 U6.2(RX)
NetL8_2: L8.2 L9.1 U6.13(PA_OUT)
NetL11_2: L11.2 U6.16(VCC1)
NetU6_7: U6.7(LNA_IN) U8.1(IN)
NetU6_8: U6.8(RX_FLT) U8.4(OUT)

Not connected (* = marked no-connect by the designer): U6 3(TX_ALT)* 14(N/C)*

### Channels
Principal/FrontEnd: designators end in A; ports ANTENA=NetC41A_1 CSD=SX1302_CSD_Principal PA_ON=SX1302_PA_ON_Principal RFI=SYS_RFI_Principal RFO=SYS_RFO_Principal RXTX_SW=SX1302_RXTX_SW_Principal VCC_FEM=VCC_FEM_Principal
Redundado/FrontEnd: designators end in B; ports ANTENA=NetC41A_1 CSD=SX1302_CSD_Redundado PA_ON=SX1302_PA_ON_Redundado RFI=SYS_RFI_Redundado RFO=SYS_RFO_Redundado RXTX_SW=SX1302_RXTX_SW_Redundado VCC_FEM=VCC_FEM_Redundado

### Layout directives
net class RF: NetC38A_1, NetC39A_1, NetC40A_1, NetC40A_2, NetC41A_1, NetC41A_2, NetC42A_1, NetC42A_2, NetC43A_1, NetC43A_2, NetL8A_2, NetU6A_7, NetU6A_8, SYS_RFI_Principal, SYS_RFO_Principal

### Notes on the sheet
- Control Lines
- Project Title:
- Author:
- Sheet Title:
- Date:
- Revision:
- Sheet
- of

### Library data of the parts
C33 = Cap: Capacitor; MPN: CGA5L3X8R1C475M160AB; Manufacturer: TDK Corporation; Package: 0603; Price (USD): 0.8; ComponentLink2Description: SupplierLink; ComponentLink1Description: Datasheet; ComponentLink2URL: https://www.digikey.com/es/products/detail/tdk-corporation/C3216X8R1C475K160AE/5809291; ComponentLink1URL: https://www.digikey.com/es/products/detail/tdk-corporation/C3216X8R1C475K160AE/5809291; Value: 4.7uF 16V X8R; Supplier: Digikey
C34 = Cap: Capacitor; MPN: C0603C103J3HAC7867; Manufacturer: KEMET; Package: 0603; Price (USD): 0.15; ComponentLink2Description: SupplierLink; ComponentLink1Description: Datasheet; ComponentLink2URL: https://www.digikey.com/es/products/detail/kemet/C0603C103J3HAC7867/2209299; ComponentLink1URL: https://connect.kemet.com:7667/gateway/IntelliData-ComponentDocumentation/1.0/download/datasheet/C0603C103J3HACTU; Value: 10nF 25V X8R; Supplier: Digikey
C35 = Cap: Capacitor; MPN: C0603C102J1HACAUTO; Manufacturer: KEMET; Package: 0603; Price (USD): 0.21; ComponentLink2Description: SupplierLink; ComponentLink1Description: Datasheet; ComponentLink2URL: https://www.digikey.com/es/products/detail/kemet/C0603C102J1HACAUTO/7516207; ComponentLink1URL: https://connect.kemet.com:7667/gateway/IntelliData-ComponentDocumentation/1.0/download/datasheet/C0603C102J1HACAUTO; Value: 1nF 100V X8R; Supplier: Digikey
C36 = Cap: Capacitor; MPN: GJM1555C1H330GB01; Manufacturer: Murata Electronics; Package: 0603; Price (USD): 0.21; ComponentLink2Description: SupplierLink; ComponentLink1Description: Datasheet; ComponentLink2URL: https://www.digikey.com/es/products/detail/murata-electronics/GJM1555C1H330GB01D/11618541?s=N4IgTCBcDaIOICkCyBGArBgwigEgZjwAY4AhQlEAXQF8g; ComponentLink1URL: https://search.murata.co.jp/Ceramy/image/img/A01X/G101/ENG/GJM1555C1H330GB01-01.pdf; Value: 33pF 50V C0G; Supplier: Digikey
C37 = Cap: Capacitor; MPN: GRM1555C2A121GE01; Manufacturer: Murata Electronics; Package: 0603; Price (USD): 0.1; ComponentLink2Description: SupplierLink; ComponentLink1Description: Datasheet; ComponentLink2URL: https://www.digikey.com/es/products/detail/murata-electronics/GRM1555C2A121GE01D/16033666?s=N4IgTCBcDaIOICUCyBGArBgwmAgisKcAogAwogC6AvkA; ComponentLink1URL: https://search.murata.co.jp/Ceramy/image/img/A01X/G101/ENG/GRM1555C2A121GE01-01A.pdf; Value: 120pF 100V C0G; Supplier: Digikey
C38 = Cap: as C18 on sheet Gateway; Package: 0603; Price (USD): 0.1; ComponentLink2Description: SupplierLink; ComponentLink1Description: Datasheet; ComponentLink2URL: https://www.digikey.com/es/products/detail/murata-electronics/GRM0335C1H100FA01D/4358087; ComponentLink1URL: https://search.murata.co.jp/Ceramy/image/img/A01X/G101/ENG/GRM0335C1H100FA01-01.pdf; Value: 10pF 50V C0G; Supplier: Digikey
C39 = Cap: as C28 on sheet SX126x; Package: 0603; Price (USD): 0.1; ComponentLink2Description: SupplierLink; ComponentLink1Description: Datasheet; ComponentLink2URL: https://www.digikey.com/es/products/detail/murata-electronics/GJM0335C1H2R4WB01D/11618768?s=N4IgTCBcDaIOICkCyAGAzGgrAYQIwAkwAlAFgHUAhFXEAXQF8g; ComponentLink1URL: https://search.murata.co.jp/Ceramy/image/img/A01X/G101/ENG/GJM0335C1H2R4WB01-01.pdf; Value: 2.4pF 50V C0G; Supplier: Digikey
C40 C41 C43 C45-C47 = Cap: Capacitor; MPN: 0603J0500560KCT; Manufacturer: Knowles Syfer; Package: 0603; Price (USD): 0.1; ComponentLink2Description: SupplierLink; ComponentLink1Description: Datasheet; Value: 56pF 50V C0G; Supplier: Digikey
  C40 C46 C47: ComponentLink2URL: *; ComponentLink1URL: *
  C41 C43 C45: ComponentLink2URL: https://www.digikey.com/es/products/detail/knowles-syfer/0603J0500560KCT/6285109; ComponentLink1URL: https://www.knowlescapacitors.com/getattachment/2dbfc8bc-e2b3-4b4d-afb1-43b011b9ebe0/High-Std-Voltage.aspx
C42 = Cap: Capacitor; MPN: GJM0335C1H2R1BB01; Manufacturer: Murata Electronics; Package: 0402; Price (USD): 0.1; ComponentLink2Description: SupplierLink; ComponentLink1Description: Datasheet; ComponentLink2URL: https://www.digikey.com/es/products/detail/murata-electronics/GJM0335C1H2R1BB01D/9758981?s=N4IgTCBcDaIOICkCyAGAzGgrAYQIwAkwAlXAIVJVxAF0BfIA; ComponentLink1URL: https://search.murata.co.jp/Ceramy/image/img/A01X/G101/ENG/GJM0335C1H2R1BB01-01.pdf; Value: 2.1pF 50V C0G; Supplier: Digikey
C44 = Cap: as C30 on sheet SX126x; Package: 0603; Price (USD): 0.1; ComponentLink2Description: SupplierLink; ComponentLink1Description: Datasheet; ComponentLink2URL: https://www.digikey.com/es/products/detail/murata-electronics/GJM0335C1H1R8WB01D/11618749?s=N4IgTCBcDaIOICkCyAGAzGgrAYQIwAlcAlADgHUAhFXEAXQF8g; ComponentLink1URL: https://search.murata.co.jp/Ceramy/image/img/A01X/G101/ENG/GJM0335C1H1R8WB01-01.pdf; Value: 1.8pF 50V C0G; Supplier: Digikey
D5 = TVSdiode: LXES Series - ESD Protection Device - Ultra Low Capacitance; Manufacturer: Murata Electronics; ComponentLink1Description: Datasheet; ComponentLink2Description: SupplierLink; MPN: LXES15AAA1-153; Package: 0402; Price (USD): 0.25; Supplier: Digikey; Value: LXES Series - ESD Protection Device - Ultra Low Capacitance
L8 = IND: Inductor; Manufacturer: Murata Electronics; MPN: LQW15AN6N8G80D; Package: 0402; Price (USD): 0.26; Value: 6.8nH 1.45A; ComponentLink1Description: Datasheet; ComponentLink1URL: https://search.murata.co.jp/Ceramy/image/img/P02/JELF243A-0100.pdf; ComponentLink2Description: SupplierLink; ComponentLink2URL: https://www.digikey.com/es/products/detail/murata-electronics/LQW15AN6N8G80D/4905972?s=N4IgTCBcDaIDIEUDqBGArAQQHIDYsA4BxfABgBEQBdAXyA; Supplier: Digikey
L9 = IND: Inductor; Manufacturer: Murata Electronics; MPN: LQG15WZ2N7C02D; Package: 0402; Price (USD): 0.16; Value: 2.7nH 900mA; ComponentLink1Description: Datasheet; ComponentLink1URL: https://search.murata.co.jp/Ceramy/image/img/P02/JELF243B-9117.pdf; ComponentLink2Description: SupplierLink; ComponentLink2URL: https://www.digikey.com/es/products/detail/murata-electronics/LQG15WZ2N7C02D/6798698?s=N4IgTCBcDaIDIEUDiBGArAdQFpgHIHYBhABjABEQBdAXyA; Supplier: Digikey
L10 = IND: Inductor; Manufacturer: Murata Electronics; MPN: LQW15AN7N5J00D; Package: 0402; Price (USD): 0.16; Value: 7.5nH 570mA; ComponentLink1Description: Datasheet; ComponentLink1URL: https://search.murata.co.jp/Ceramy/image/img/P02/JELF243A-0050.pdf; ComponentLink2Description: SupplierLink; ComponentLink2URL: https://www.digikey.com/es/products/detail/murata-electronics/LQW15AN7N5J00D/584352?s=N4IgTCBcDaIDIEUDqBGArAQQHIHYtoCkAGIgERAF0BfIA; Supplier: Digikey
L11 = IND: Inductor; Manufacturer: Murata Electronics; MPN: LQP15MN1N2B02; Package: 0402; Price (USD): 0.1; Value: 1.2nH 390mA; ComponentLink1Description: Datasheet; ComponentLink1URL: https://search.murata.co.jp/Ceramy/image/img/P02/JELF243C-0007.pdf; ComponentLink2Description: SupplierLink; ComponentLink2URL: https://www.digikey.com/es/products/detail/murata-electronics/LQP15MN1N2B02D/584334?s=N4IgTCBcDaIDIEUAKBGArAWQHIq2AQgAwQC6AvkA; Supplier: Digikey
L12 = IND: Inductor; Manufacturer: Murata Electronics; MPN: LQW15AN4N7C00; Package: 0402; Price (USD): 0.17; Value: 4.7nH 750mA; ComponentLink1Description: Datasheet; ComponentLink1URL: https://search.murata.co.jp/Ceramy/image/img/P02/JELF243A-0050.pdf; ComponentLink2Description: SupplierLink; ComponentLink2URL: https://www.digikey.com/es/products/detail/murata-electronics/LQW15AN4N7C00D/584348?s=N4IgTCBcDaIDIEUDqBGArAQQHIBYsHYBhABmJAF0BfIA; Supplier: Digikey
L13 = IND: Inductor; Manufacturer: Murata Electronics; MPN: LQG15HN3N3S02; Package: 0402; Price (USD): 0.1; Value: 3.3nH 800mA; ComponentLink1Description: Datasheet; ComponentLink1URL: https://search.murata.co.jp/Ceramy/image/img/P02/JELF243B-0009.pdf; ComponentLink2Description: SupplierLink; ComponentLink2URL: https://www.digikey.com/es/products/detail/murata-electronics/LQG15HN3N3S02D/2594210?s=N4IgTCBcDaIDIEUDiBGArACQHIGZcGUAGCAXQF8g; Supplier: Digikey
R13-R15 = Res: Resistor; Manufacturer: Stackpole Electronics; MPN: RMCF0201JT1K00; Package: 0603; Price (USD): 0.1; Value: 1k 5% 1/20W; ComponentLink1Description: Datasheet; ComponentLink2Description: SupplierLink; Supplier: Digikey
  R13: ComponentLink1URL: https://www.digikey.com/es/products/detail/stackpole-electronics-inc/RMCF0201JT1K00/1714962; ComponentLink2URL: https://www.digikey.com/es/products/detail/stackpole-electronics-inc/RMCF0201JT1K00/1714962
  R14 R15: ComponentLink1URL: *; ComponentLink2URL: *
U5 U7 U8 = SAW Filter RF360: Manufacturer: Qualcomm; MPN: B39921B4344P810; Value: 915MHz Frequency General Purpose RF SAW Filter (Surface Acoustic Wave) 2.8dB 26MHz Bandwidth 5-SMD, No Lead; ComponentLink1Description: Datasheet; ComponentLink2Description: SupplierLink; Package: QCS5P 1.4x1.1mm; Price (USD): 1.82; Supplier: Digikey
U6 = SKY66423-11: SKY66423-11 - 860 to 930MHz Front-End Module; Manufacturer: Skyworks Solutions; Value: RF Front End 860MHz ~ 930MHz; ComponentLink1Description: Datasheet; ComponentLink1URL: https://www.skyworksinc.com/-/media/SkyWorks/Documents/Products/2801-2900/SKY66423_11_204566J.pdf; ComponentLink2Description: SupplierLink; ComponentLink2URL: https://www.digikey.com/en/products/detail/skyworks-solutions-inc/SKY66423-11/9603432; MPN: SKY66423-11; Package: MCM-16 3x3mm; Price (USD): 3; Supplier: Digikey